# EAGLE schematic V1_schematic (EAGLE 8.3.0), part 1 of 2

## Sheet 1 of 6
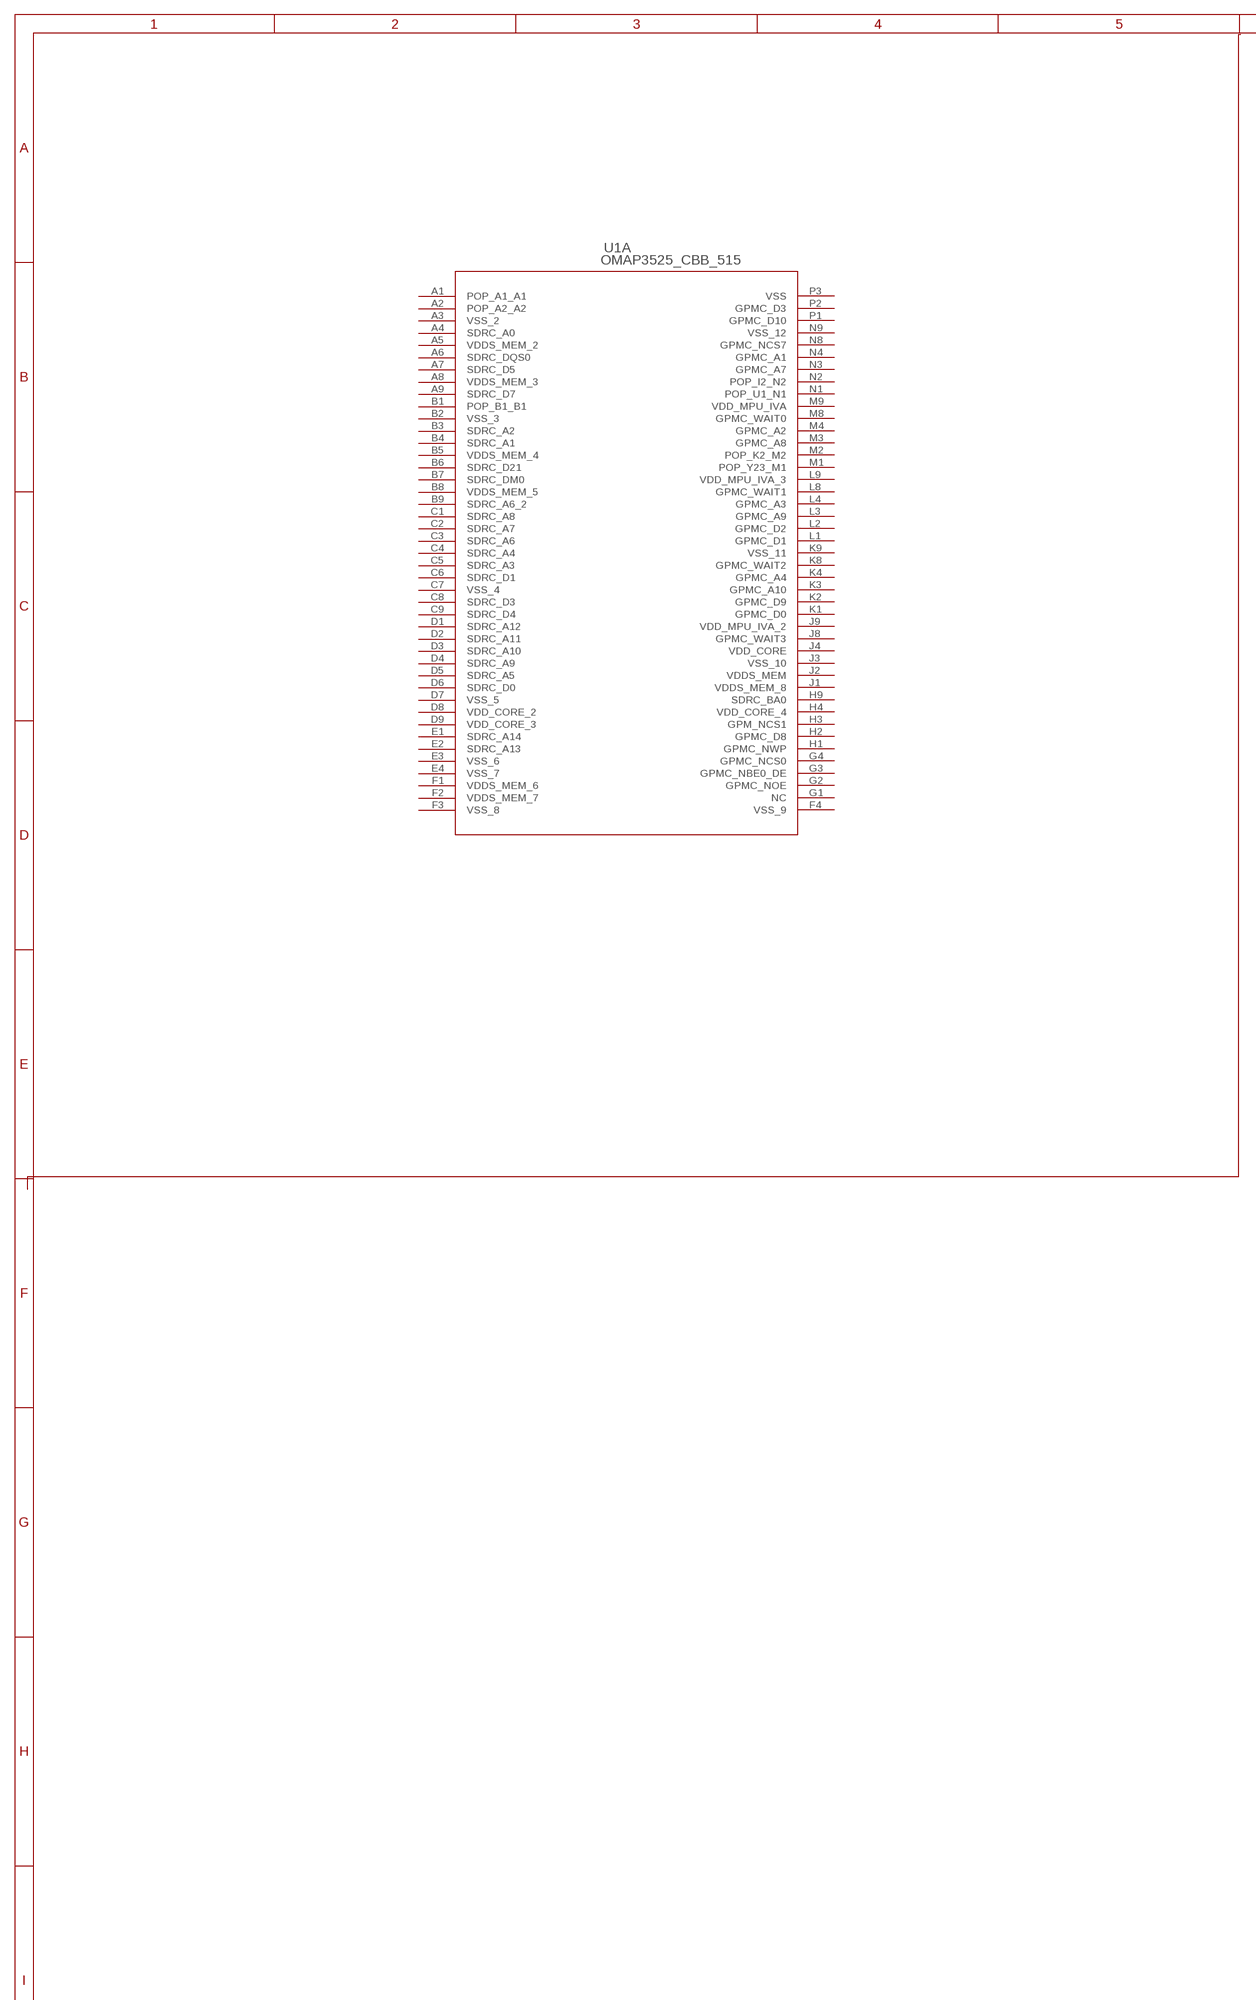
[diagram p0: schematic, sheet 1, part 1 of 2]
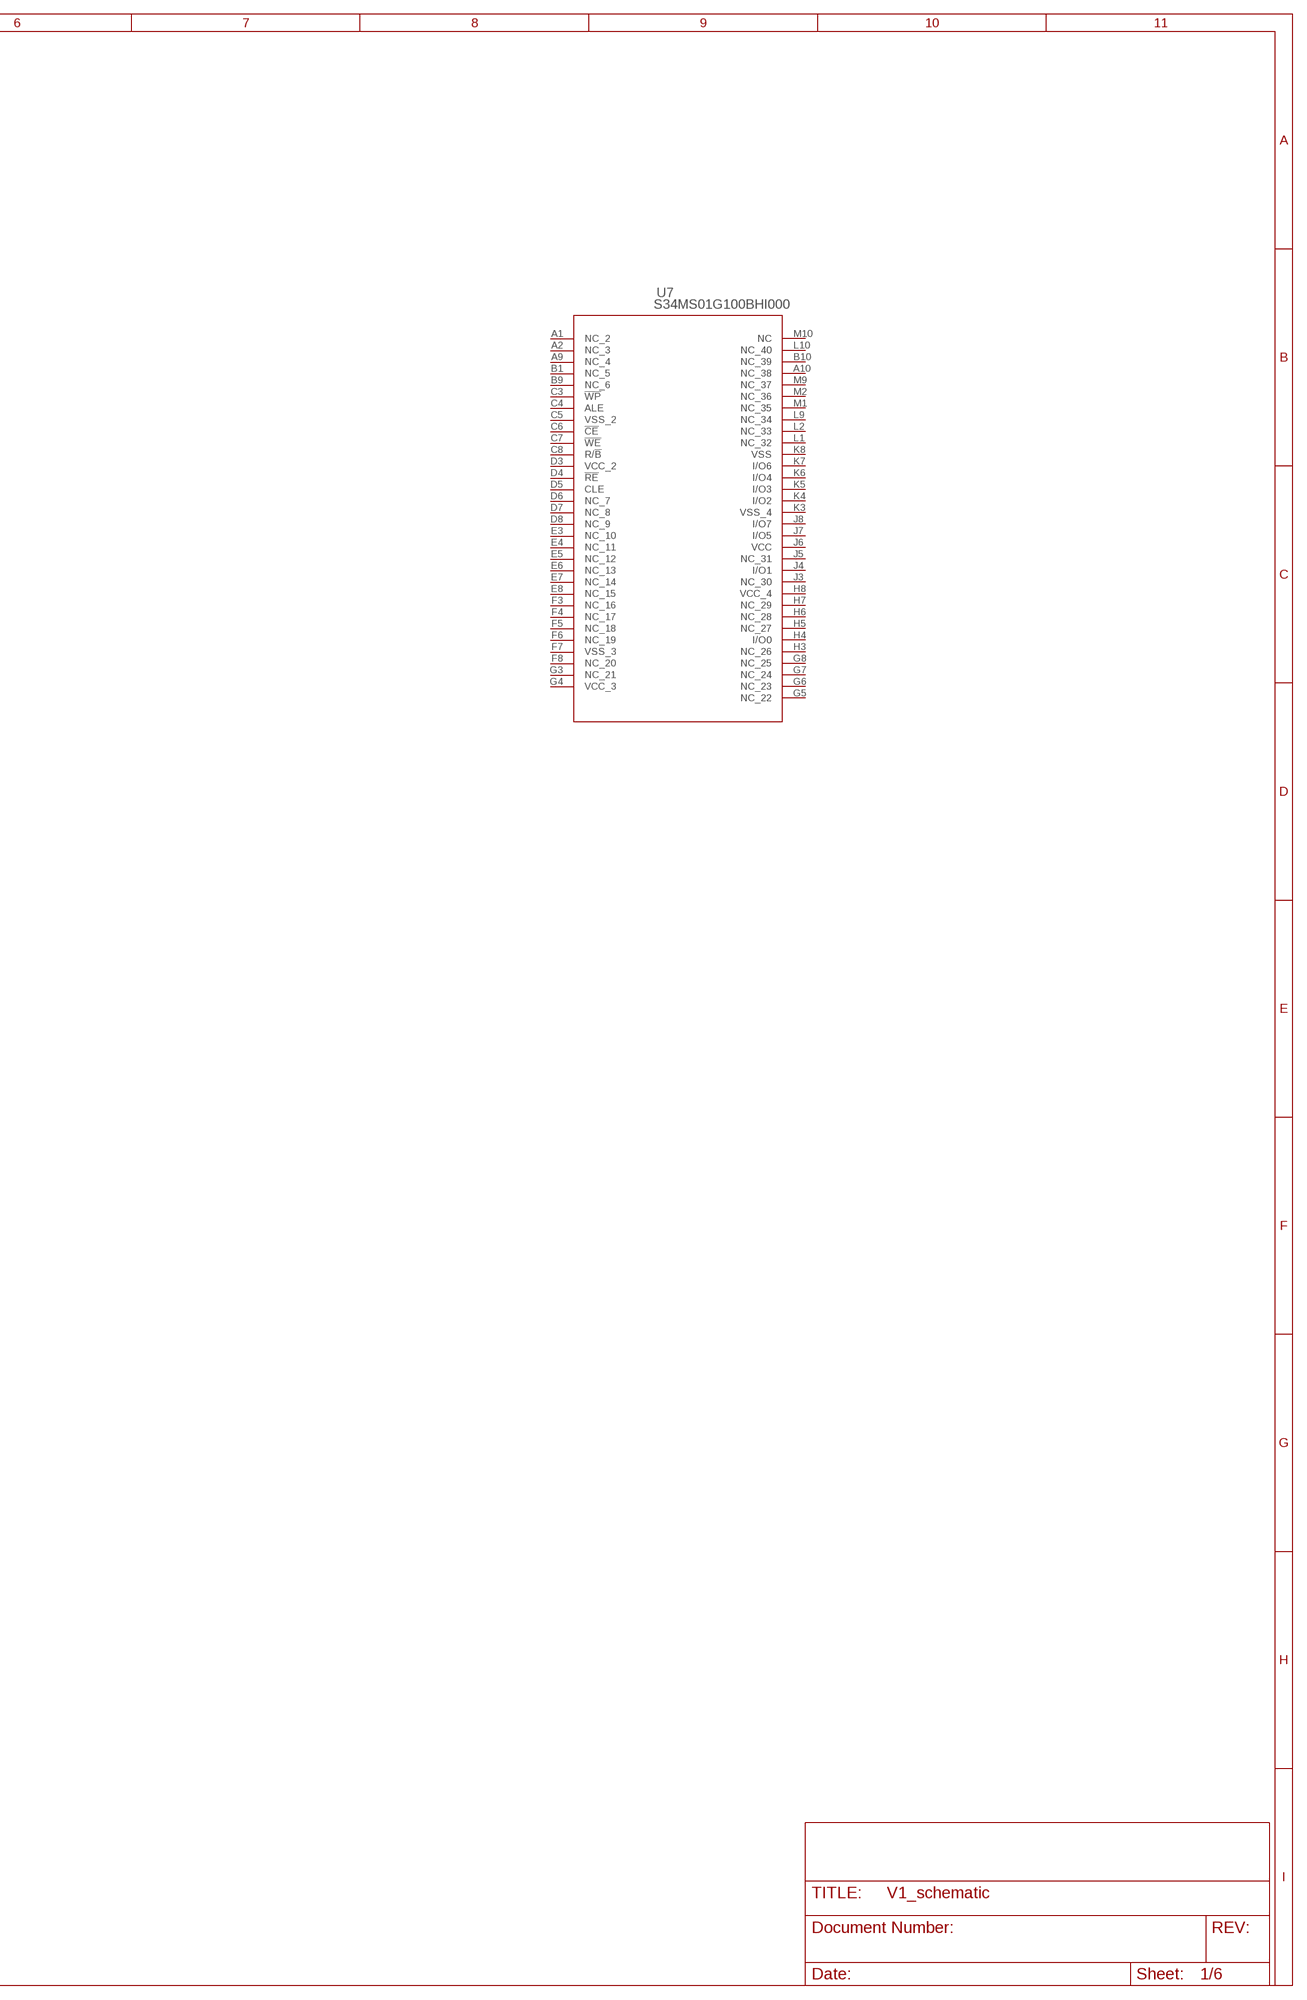
[diagram p1: schematic, sheet 1, part 2 of 2]

### Parts
U1  OMAP3525_CBB_515  [CBB515]
U7  S34MS01G100BHI000  [VBM063]
Unconnected: U1.A1(A:POP_A1_A1) U1.A2(A:POP_A2_A2) U1.A4(A:SDRC_A0) U1.A6(A:SDRC_DQS0) U1.A7(A:SDRC_D5) U1.A9(A:SDRC_D7) U1.A10(B:SDRC_DQS2) U1.A11(B:SDRC_D21) U1.A13(B:SDRC_CLK) U1.A14(B:SDRC_NCLK) U1.A15(B:POP_A12_A15) U1.A16(B:SDRC_DM1) U1.A17(B:SDRC_DQS1) U1.A19(B:SDRC_D25) U1.A20(B:SDRC_DQS3) U1.A21(B:SDRC_D29) U1.A23(B:CAM_VS) U1.A24(B:CAM_HS) U1.A25(B:CAM_D5) U1.A27(B:POP_A22_A27) U1.A28(B:POP_A23_A28) U1.AA1(B:POP_AA1_AA1) U1.AA2(B:POP_AA2_AA2) U1.AA3(B:MCSPI2_CLK) U1.AA4(B:MCSPI1_SOMI) U1.AA8(B:UART1_TX) U1.AA9(B:UART1_RTS) U1.AA10(E:JTAG_EMU1) U1.AA11(E:JTAG_EMU0) U1.AA12(E:JTAG_RTCK) U1.AA13(E:JTAG_TCK) U1.AA15(E:CAP_VDD_WKUP) U1.AA17(E:JTAG_NTRST) U1.AA18(E:JTAG_TMS_TMSC) U1.AA19(E:JTAG_TDO) U1.AA20(E:JTAG_TDI) U1.AA21(E:MCBSP1_FSR) U1.AA25(E:UART2_TX) U1.AA27(E:DSS_DATA15) U1.AA28(E:DSS_DATA14) U1.AB1(B:MCSPI1_CS2) U1.AB2(B:MCSPI1_CS3) U1.AB3(B:MCSPI1_CLK) U1.AB4(B:MCSPI1_SIMO) U1.AB25(E:UART2_RTS) U1.AB26(E:UART2_CTS) U1.AB27(E:DSS_DATA13) U1.AB28(F:DSS_DATA12) U1.AC1(B:MCSPI1_FSX) U1.AC2(B:MCSPI1_CS0) U1.AC3(B:MCSPI1_CS1) U1.AC27(F:DSS_DATA22) U1.AC28(F:DSS_DATA23) U1.AD1(B:MCBSP4_DR) U1.AD2(B:MCBSP4_DX) U1.AD25(F:UART2_RX) U1.AD26(F:I2C4_SCL) U1.AD27(F:DSS_DATA11) U1.AD28(F:DSS_DATA10) U1.AE1(B:MCBSP4_CLKX) U1.AE2(B:MMC2_CLK) U1.AE3(B:MMC2_DAT7) U1.AE4(B:MMC2_DAT4) U1.AE5(B:MCBSP3_FSX) U1.AE6(B:MCBSP3_DR) U1.AE7(B:ETK_D10) U1.AE10(F:ETK_CTL) U1.AE11(F:ETK_D4) U1.AE13(F:ETK_D3) U1.AE14(F:SYS_BOOT2) U1.AE15(F:I2C2_SDA) U1.AE17(F:SYS_XTALIN) U1.AE21(F:SYS_BOOT5) U1.AE22(F:SYS_CLKOUT2) U1.AE25(F:SYS_32K) U1.AE26(F:I2C4_SDA) U1.AE28(F:POP_AA23_AE28) U1.AF1(B:POP_AC8_AF1) U1.AF2(C:POP_U2_AF2) U1.AF3(C:MMC2_DAT6) U1.AF4(C:MMC2_DAT3) U1.AF5(C:MCBSP3_CLKX) U1.AF6(C:MCBSP3_DX) U1.AF7(C:ETK_D11) U1.AF9(C:ETK_D8) U1.AF10(F:ETK_CLK) U1.AF11(F:ETK_D0) U1.AF13(F:ETK_D6) U1.AF14(F:I2C3_SCL) U1.AF15(F:I2C2_SCL) U1.AF17(F:SYS_XTALOUT) U1.AF18(F:SYS_BOOT3) U1.AF19(F:SYS_BOOT4) U1.AF21(F:SYS_BOOT6) U1.AF22(F:SYS_OFF_MODE) U1.AF24(F:SYS_NRESWARM) U1.AF25(F:SYS_CLKREQ) U1.AF26(F:SYS_NIRQ) U1.AF27(F:POP_AA22_AF27) U1.AF28(F:POP_H23_AF28) U1.AG1(C:POP_AB1_AG1) U1.AG4(C:MMC2_DAT2) U1.AG5(C:MMC2_CMD) U1.AG7(C:ETK_D12) U1.AG8(C:ETK_D14) U1.AG9(C:ETK_D9) U1.AG10(F:POP_AB8_AG10) U1.AG11(F:POP_AB9_AG11) U1.AG12(F:ETK_D1) U1.AG13(F:POP_AB11_AG13) U1.AG14(F:I2C3_SDA) U1.AG15(F:POP_AB13_AG15) U1.AG17(F:CAM_D0) U1.AG18(F:GPIO_114) U1.AG19(F:GPIO_112) U1.AG22(F:DSS_DATA0) U1.AG23(F:DSS_DATA2) U1.AG24(F:DSS_DATA4) U1.AG25(F:SYS_CLKOUT1) U1.AG26(F:SYS_BOOT1) U1.AG28(F:POP_AB23_AG28) U1.AH1(C:POP_AC1_AH1) U1.AH2(C:POP_AC2_AH2) U1.AH3(C:MMC2_DAT5) U1.AH4(C:MMC2_DAT1) U1.AH5(C:MMC2_DAT0) U1.AH7(C:ETK_D13) U1.AH8(C:ETK_D15) U1.AH9(C:ETK_D5) U1.AH10(F:POP_AC13_AH10) U1.AH11(F:POP_AC9_AH11) U1.AH12(F:ETK_D2) U1.AH13(F:POP_AC11_AH13) U1.AH14(F:ETK_D7) U1.AH15(F:POP_I1_AH15) U1.AH16(F:POP_AC14_AH16) U1.AH17(F:CAM_D1) U1.AH18(F:GPIO_115) U1.AH19(F:GPIO_113) U1.AH20(F:CAP_VDD_D) U1.AH22(F:DSS_DATA1) U1.AH23(F:DSS_DATA3) U1.AH24(F:DSS_DATA5) U1.AH25(F:SYS_NRESPWRON) U1.AH26(F:SYS_BOOT0) U1.AH27(F:POP_AC22_AH27) U1.AH28(F:POP_AC23_AH28) U1.B1(A:POP_B1_B1) U1.B3(A:SDRC_A2) U1.B4(A:SDRC_A1) U1.B6(A:SDRC_D21) U1.B7(A:SDRC_DM0) U1.B9(A:SDRC_A6_2) U1.B10(C:SDRC_D17) U1.B11(C:SDRC_DM2) U1.B13(C:SDRC_D22) U1.B14(C:SDRC_D9) U1.B15(C:POP_B12_B15) U1.B16(C:SDRC_D11) U1.B17(C:SDRC_D14) U1.B19(C:SDRC_D26) U1.B20(C:SDRC_D27) U1.B21(C:SDRC_D30) U1.B23(C:CAM_WEN) U1.B24(C:CAM_D2) U1.B25(C:CAM_D10) U1.B26(C:CAM_XCLKB) U1.B28(C:POP_B23_B28) U1.C1(A:SDRC_A8) U1.C2(A:SDRC_A7) U1.C3(A:SDRC_A6) U1.C4(A:SDRC_A4) U1.C5(A:SDRC_A3) U1.C6(A:SDRC_D1) U1.C8(A:SDRC_D3) U1.C9(A:SDRC_D4) U1.C11(C:SDRC_D18) U1.C12(C:SDRC_D20) U1.C14(C:SDRC_D8) U1.C15(C:SDRC_D10) U1.C17(C:SDRC_D13) U1.C18(C:SDRC_D24) U1.C20(C:SDRC_DM3) U1.C21(C:SDRC_D31) U1.C23(C:CAM_FLD) U1.C24(C:CAM_D3) U1.C25(C:CAM_XCLKA) U1.C26(C:CAM_D11) U1.C27(C:CAM_PCLK) U1.D1(A:SDRC_A12) U1.D2(A:SDRC_A11) U1.D3(A:SDRC_A10) U1.D4(A:SDRC_A9) U1.D5(A:SDRC_A5) U1.D6(A:SDRC_D0) U1.D11(C:SDRC_D16) U1.D12(C:SDRC_D19) U1.D14(C:SDRC_D23) U1.D17(C:SDRC_D12) U1.D18(C:SDRC_D15) U1.D20(C:SDRC_D28) U1.D24(C:CAM_D4) U1.D25(C:CAM_STROBE) U1.D26(C:DSS_HSYNC) U1.D27(C:DSS_VSYNC) U1.D28(C:DSS_PCLK) U1.E1(A:SDRC_A14) U1.E2(A:SDRC_A13) U1.E26(C:DSS_DATA6) U1.E27(C:DSS_ACBIAS) U1.E28(D:DSS_DATA20) U1.F27(D:DSS_DATA8) U1.F28(D:DSS_DATA7) U1.G1(A:NC) U1.G2(A:GPMC_NOE) U1.G3(A:GPMC_NBE0_DE) U1.G4(A:GPMC_NCS0) U1.G25(D:DSS_DATA16) U1.G26(D:DSS_DATA9) U1.H1(A:GPMC_NWP) U1.H2(A:GPMC_D8) U1.H3(A:GPM_NCS1) U1.H9(A:SDRC_BA0) U1.H10(D:SDRC_BA1) U1.H11(D:SDRC_NCS0) U1.H12(D:SDRC_NCS1) U1.H13(D:SDRC_NCAS) U1.H14(D:SDRC_NRAS) U1.H15(D:SDRC_NWE) U1.H16(D:SDRC_CKE0) U1.H17(D:SDRC_CKE1) U1.H18(D:UART3_CTS_RCTX) U1.H19(D:UART3_RTS_SD) U1.H20(D:UART3_RX_IRRX) U1.H21(D:UART3_TX_IRTX) U1.H25(D:DSS_DATA19) U1.H26(D:DSS_DATA18) U1.H27(D:DSS_DATA17) U1.J8(A:GPMC_WAIT3) U1.J21(D:I2C1_SDA) U1.J25(D:HDQ_SIO) U1.J26(D:DSS_DATA21) U1.J27(D:POP_H22_J27) U1.J28(D:POP_K1_J28) U1.K1(A:GPMC_D0) U1.K2(A:GPMC_D9) U1.K3(A:GPMC_A10) U1.K4(A:GPMC_A4) U1.K8(A:GPMC_WAIT2) U1.K21(D:I2C1_SCL) U1.K26(D:MCBSP1_FSX) U1.K27(D:CAM_D8) U1.K28(D:CAM_D6) U1.L1(A:GPMC_D1) U1.L2(A:GPMC_D2) U1.L3(A:GPMC_A9) U1.L4(A:GPMC_A3) U1.L8(A:GPMC_WAIT1) U1.L21(D:CAP_VDD_SRAM_CORE) U1.L25(D:CDD_CORE) U1.L27(D:CAM_D9) U1.L28(D:CAM_D7) U1.M1(A:POP_Y23_M1) U1.M2(A:POP_K2_M2) U1.M3(A:GPMC_A8) U1.M4(A:GPMC_A2) U1.M8(A:GPMC_WAIT0) U1.M21(D:MCBSP2_DX) U1.M26(D:POP_K22_M26) U1.M27(D:MMC1_CMD) U1.N1(A:POP_U1_N1) U1.N2(A:POP_I2_N2) U1.N3(A:GPMC_A7) U1.N4(A:GPMC_A1) U1.N8(A:GPMC_NCS7) U1.N21(D:MCBSP2_CLKX) U1.N25(D:MMC1_DAT2) U1.N26(D:MMC1_DAT1) U1.N27(D:MMC1_DA0) U1.N28(D:MMC1_CLK) U1.P1(A:GPMC_D10) U1.P2(A:GPMC_D3) U1.P8(B:GPMC_NCS6) U1.P21(D:MCBSP2_FSX) U1.P26(E:MMC1_DAT5) U1.P27(E:MMC1_DAT4) U1.P28(E:MMC1_DAT3) U1.R1(B:GPMC_D11) U1.R2(B:GPMC_D12) U1.R3(B:GPMC_A6) U1.R8(B:GPMC_NCS5) U1.R21(E:MCBSP2_DR) U1.R25(E:MMC1_DAT7) U1.R27(E:MMC1_DAT6) U1.R28(E:HSUSB0_DIR) U1.T1(B:GMC_D4) U1.T2(B:GPMC_D13) U1.T3(B:GPMC_A5) U1.T4(B:GPMC_CLK) U1.T8(B:GPMC_NCS4) U1.T21(E:MCBSP_CLKS) U1.T25(E:HSUSB0_STP) U1.T26(E:HSUSB0_NXT) U1.T27(E:HSUSB0_DATA0) U1.T28(E:HSUSB0_CLK) U1.U3(B:GPMC_NBE1) U1.U4(B:NC) U1.U8(B:GPMC_NCS3) U1.U21(E:MCBSP1_DR) U1.U25(E:HSUSB0_DATA4) U1.U26(E:HSUSB0_DATA3) U1.U27(E:HSUSB0_DATA2) U1.U28(E:HSUSB0_DATA1) U1.V1(B:GPMC_D5) U1.V2(B:GPMC_D6) U1.V3(B:MCSPI2_CS1) U1.V4(B:V4) U1.V8(B:GPMC_NCS2) U1.V21(E:MCBSP1_DX) U1.V26(E:HSUSB0_DATA7) U1.V27(E:HSUSB0_DATA6) U1.V28(E:HSUSB0_DATA5) U1.W1(B:GPMC_D14) U1.W2(B:GPMC_D7) U1.W8(B:UART1_CTS) U1.W21(E:MCBSP1_CLKX) U1.W26(E:TV_VREF) U1.W27(E:TV_VFB2) U1.W28(E:TV_OUT2) U1.Y1(B:GPMC_D15) U1.Y2(B:MCSPI2_SIMO) U1.Y3(B:MCSPI2_SOMI) U1.Y4(B:MCSPI2_CS0) U1.Y8(B:UART1_RX) U1.Y21(E:MCBSP1_CLKR) U1.Y27(E:TV_VFB1) U1.Y28(E:TV_OUT1) U7.A1(NC_2) U7.A2(NC_3) U7.A9(NC_4) U7.A10(NC_38) U7.B1(NC_5) U7.B9(NC_6) U7.B10(NC_39) U7.C3(!WP) U7.C4(ALE) U7.C6(!CE) U7.C7(!WE) U7.C8(R/!B) U7.D4(!RE) U7.D5(CLE) U7.D6(NC_7) U7.D7(NC_8) U7.D8(NC_9) U7.E3(NC_10) U7.E4(NC_11) U7.E5(NC_12) U7.E6(NC_13) U7.E7(NC_14) U7.E8(NC_15) U7.F3(NC_16) U7.F4(NC_17) U7.F5(NC_18) U7.F6(NC_19) U7.F8(NC_20) U7.G3(NC_21) U7.G5(NC_22) U7.G6(NC_23) U7.G7(NC_24) U7.G8(NC_25) U7.H3(NC_26) U7.H4(I/O0) U7.H5(NC_27) U7.H6(NC_28) U7.H7(NC_29) U7.J3(NC_30) U7.J4(I/O1) U7.J5(NC_31) U7.J7(I/O5) U7.J8(I/O7) U7.K4(I/O2) U7.K5(I/O3) U7.K6(I/O4) U7.K7(I/O6) U7.L1(NC_32) U7.L2(NC_33) U7.L9(NC_34) U7.L10(NC_40) U7.M1(NC_35) U7.M2(NC_36) U7.M9(NC_37) U7.M10(NC)

## Sheet 2 of 6
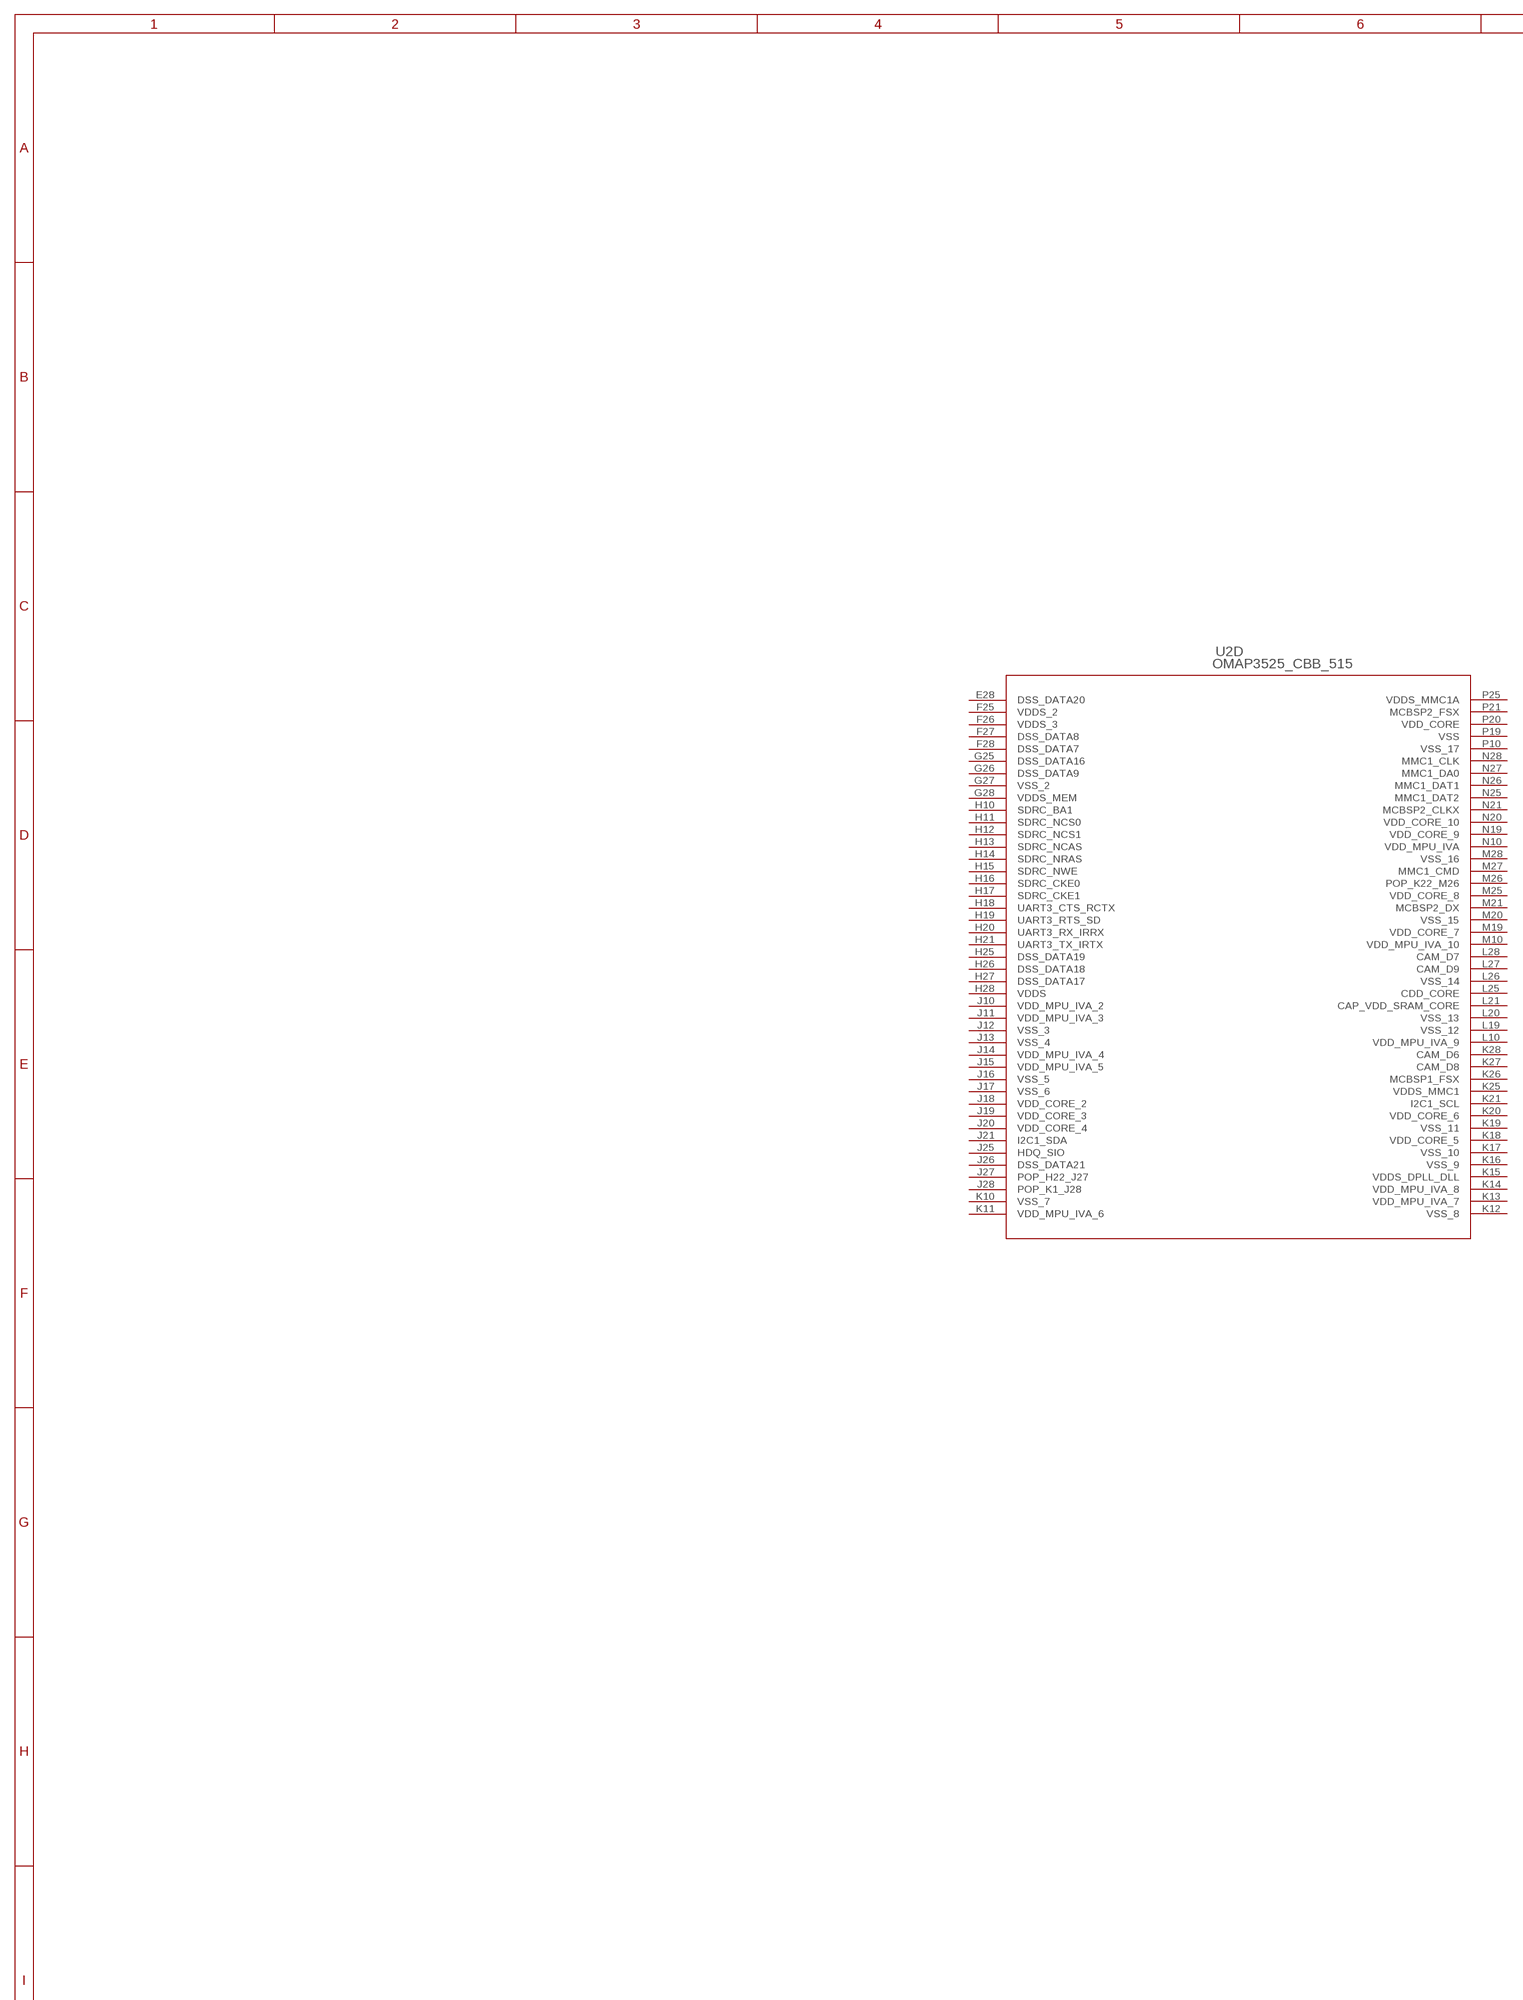
[diagram p2: schematic, sheet 2, part 1 of 2]
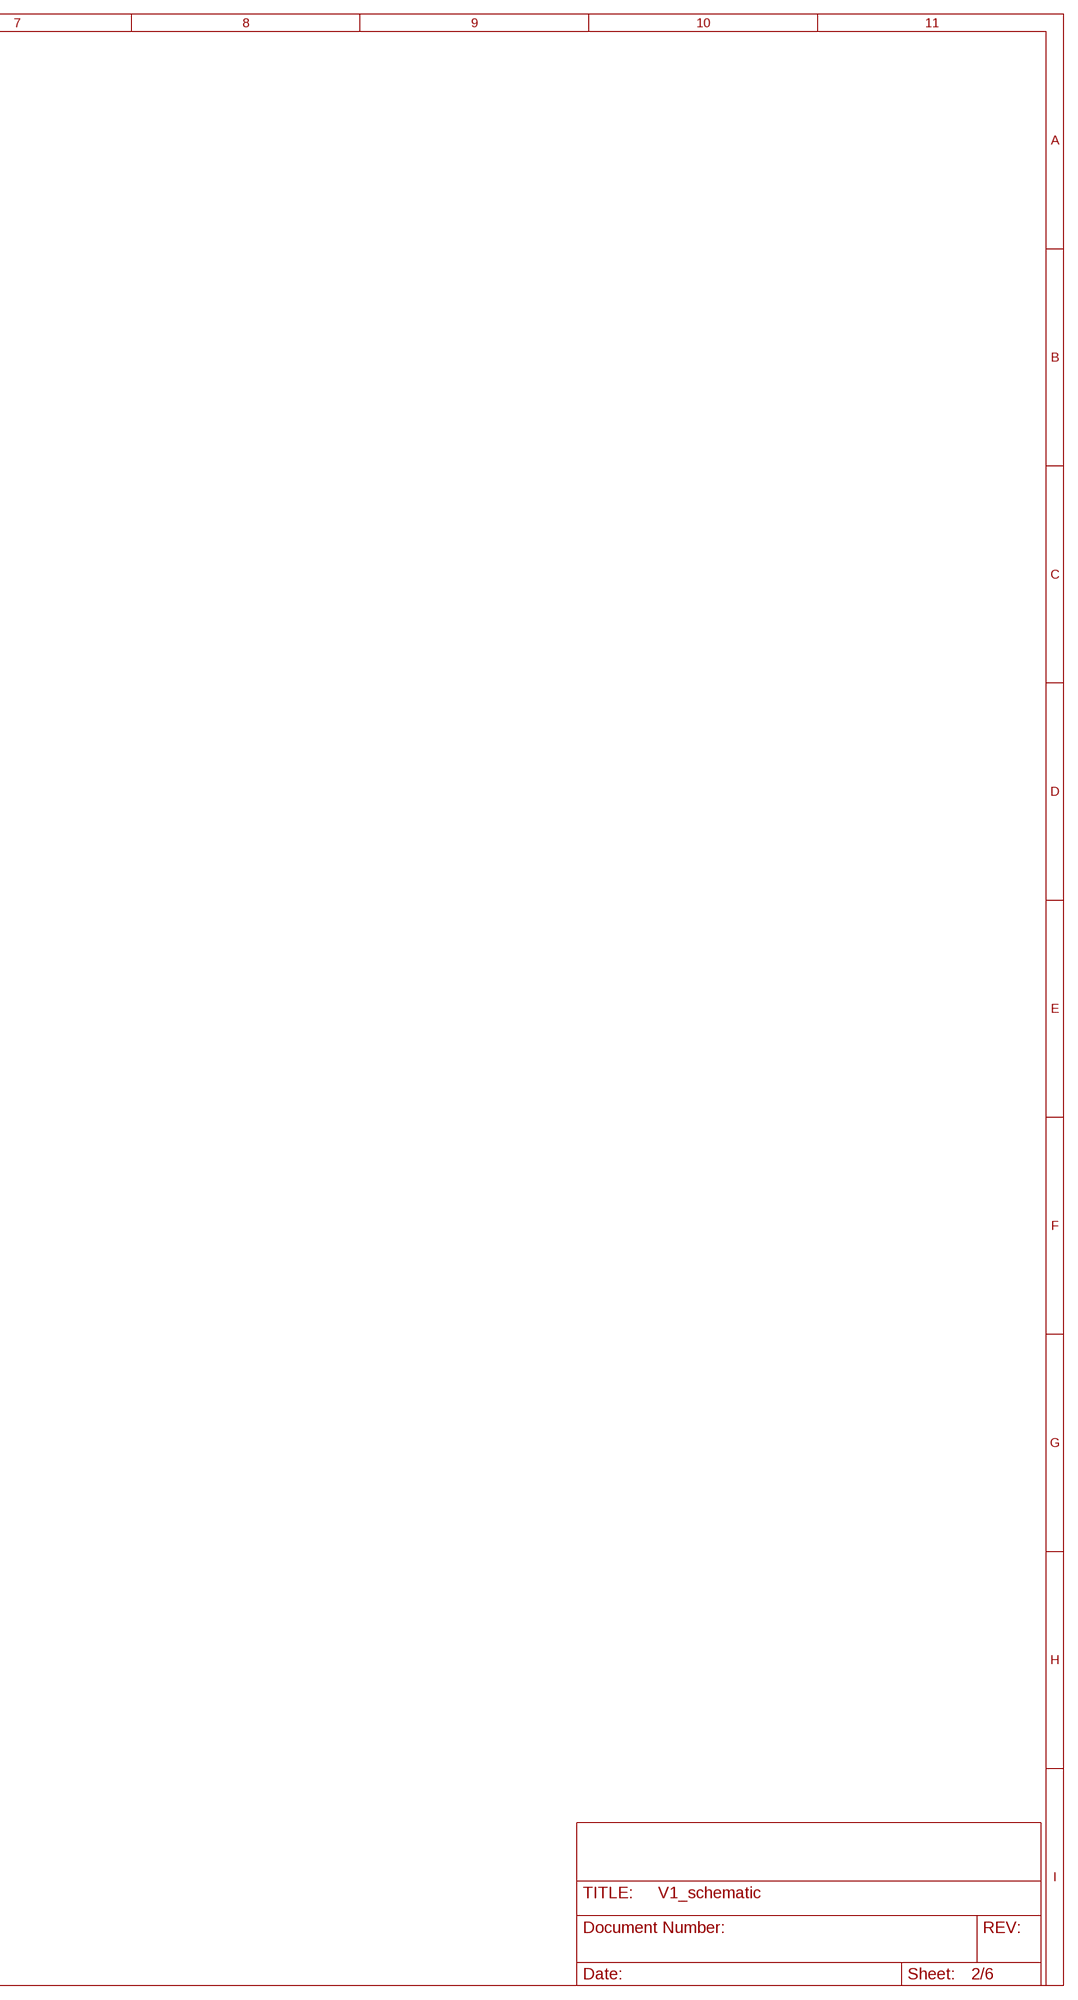
[diagram p3: schematic, sheet 2, part 2 of 2]

### Parts
U2  OMAP3525_CBB_515  [CBB515]
Unconnected: U2.A1(A:POP_A1_A1) U2.A2(A:POP_A2_A2) U2.A4(A:SDRC_A0) U2.A6(A:SDRC_DQS0) U2.A7(A:SDRC_D5) U2.A9(A:SDRC_D7) U2.A10(B:SDRC_DQS2) U2.A11(B:SDRC_D21) U2.A13(B:SDRC_CLK) U2.A14(B:SDRC_NCLK) U2.A15(B:POP_A12_A15) U2.A16(B:SDRC_DM1) U2.A17(B:SDRC_DQS1) U2.A19(B:SDRC_D25) U2.A20(B:SDRC_DQS3) U2.A21(B:SDRC_D29) U2.A23(B:CAM_VS) U2.A24(B:CAM_HS) U2.A25(B:CAM_D5) U2.A27(B:POP_A22_A27) U2.A28(B:POP_A23_A28) U2.AA1(B:POP_AA1_AA1) U2.AA2(B:POP_AA2_AA2) U2.AA3(B:MCSPI2_CLK) U2.AA4(B:MCSPI1_SOMI) U2.AA8(B:UART1_TX) U2.AA9(B:UART1_RTS) U2.AA10(E:JTAG_EMU1) U2.AA11(E:JTAG_EMU0) U2.AA12(E:JTAG_RTCK) U2.AA13(E:JTAG_TCK) U2.AA15(E:CAP_VDD_WKUP) U2.AA17(E:JTAG_NTRST) U2.AA18(E:JTAG_TMS_TMSC) U2.AA19(E:JTAG_TDO) U2.AA20(E:JTAG_TDI) U2.AA21(E:MCBSP1_FSR) U2.AA25(E:UART2_TX) U2.AA27(E:DSS_DATA15) U2.AA28(E:DSS_DATA14) U2.AB1(B:MCSPI1_CS2) U2.AB2(B:MCSPI1_CS3) U2.AB3(B:MCSPI1_CLK) U2.AB4(B:MCSPI1_SIMO) U2.AB25(E:UART2_RTS) U2.AB26(E:UART2_CTS) U2.AB27(E:DSS_DATA13) U2.AB28(F:DSS_DATA12) U2.AC1(B:MCSPI1_FSX) U2.AC2(B:MCSPI1_CS0) U2.AC3(B:MCSPI1_CS1) U2.AC27(F:DSS_DATA22) U2.AC28(F:DSS_DATA23) U2.AD1(B:MCBSP4_DR) U2.AD2(B:MCBSP4_DX) U2.AD25(F:UART2_RX) U2.AD26(F:I2C4_SCL) U2.AD27(F:DSS_DATA11) U2.AD28(F:DSS_DATA10) U2.AE1(B:MCBSP4_CLKX) U2.AE2(B:MMC2_CLK) U2.AE3(B:MMC2_DAT7) U2.AE4(B:MMC2_DAT4) U2.AE5(B:MCBSP3_FSX) U2.AE6(B:MCBSP3_DR) U2.AE7(B:ETK_D10) U2.AE10(F:ETK_CTL) U2.AE11(F:ETK_D4) U2.AE13(F:ETK_D3) U2.AE14(F:SYS_BOOT2) U2.AE15(F:I2C2_SDA) U2.AE17(F:SYS_XTALIN) U2.AE21(F:SYS_BOOT5) U2.AE22(F:SYS_CLKOUT2) U2.AE25(F:SYS_32K) U2.AE26(F:I2C4_SDA) U2.AE28(F:POP_AA23_AE28) U2.AF1(B:POP_AC8_AF1) U2.AF2(C:POP_U2_AF2) U2.AF3(C:MMC2_DAT6) U2.AF4(C:MMC2_DAT3) U2.AF5(C:MCBSP3_CLKX) U2.AF6(C:MCBSP3_DX) U2.AF7(C:ETK_D11) U2.AF9(C:ETK_D8) U2.AF10(F:ETK_CLK) U2.AF11(F:ETK_D0) U2.AF13(F:ETK_D6) U2.AF14(F:I2C3_SCL) U2.AF15(F:I2C2_SCL) U2.AF17(F:SYS_XTALOUT) U2.AF18(F:SYS_BOOT3) U2.AF19(F:SYS_BOOT4) U2.AF21(F:SYS_BOOT6) U2.AF22(F:SYS_OFF_MODE) U2.AF24(F:SYS_NRESWARM) U2.AF25(F:SYS_CLKREQ) U2.AF26(F:SYS_NIRQ) U2.AF27(F:POP_AA22_AF27) U2.AF28(F:POP_H23_AF28) U2.AG1(C:POP_AB1_AG1) U2.AG4(C:MMC2_DAT2) U2.AG5(C:MMC2_CMD) U2.AG7(C:ETK_D12) U2.AG8(C:ETK_D14) U2.AG9(C:ETK_D9) U2.AG10(F:POP_AB8_AG10) U2.AG11(F:POP_AB9_AG11) U2.AG12(F:ETK_D1) U2.AG13(F:POP_AB11_AG13) U2.AG14(F:I2C3_SDA) U2.AG15(F:POP_AB13_AG15) U2.AG17(F:CAM_D0) U2.AG18(F:GPIO_114) U2.AG19(F:GPIO_112) U2.AG22(F:DSS_DATA0) U2.AG23(F:DSS_DATA2) U2.AG24(F:DSS_DATA4) U2.AG25(F:SYS_CLKOUT1) U2.AG26(F:SYS_BOOT1) U2.AG28(F:POP_AB23_AG28) U2.AH1(C:POP_AC1_AH1) U2.AH2(C:POP_AC2_AH2) U2.AH3(C:MMC2_DAT5) U2.AH4(C:MMC2_DAT1) U2.AH5(C:MMC2_DAT0) U2.AH7(C:ETK_D13) U2.AH8(C:ETK_D15) U2.AH9(C:ETK_D5) U2.AH10(F:POP_AC13_AH10) U2.AH11(F:POP_AC9_AH11) U2.AH12(F:ETK_D2) U2.AH13(F:POP_AC11_AH13) U2.AH14(F:ETK_D7) U2.AH15(F:POP_I1_AH15) U2.AH16(F:POP_AC14_AH16) U2.AH17(F:CAM_D1) U2.AH18(F:GPIO_115) U2.AH19(F:GPIO_113) U2.AH20(F:CAP_VDD_D) U2.AH22(F:DSS_DATA1) U2.AH23(F:DSS_DATA3) U2.AH24(F:DSS_DATA5) U2.AH25(F:SYS_NRESPWRON) U2.AH26(F:SYS_BOOT0) U2.AH27(F:POP_AC22_AH27) U2.AH28(F:POP_AC23_AH28) U2.B1(A:POP_B1_B1) U2.B3(A:SDRC_A2) U2.B4(A:SDRC_A1) U2.B6(A:SDRC_D21) U2.B7(A:SDRC_DM0) U2.B9(A:SDRC_A6_2) U2.B10(C:SDRC_D17) U2.B11(C:SDRC_DM2) U2.B13(C:SDRC_D22) U2.B14(C:SDRC_D9) U2.B15(C:POP_B12_B15) U2.B16(C:SDRC_D11) U2.B17(C:SDRC_D14) U2.B19(C:SDRC_D26) U2.B20(C:SDRC_D27) U2.B21(C:SDRC_D30) U2.B23(C:CAM_WEN) U2.B24(C:CAM_D2) U2.B25(C:CAM_D10) U2.B26(C:CAM_XCLKB) U2.B28(C:POP_B23_B28) U2.C1(A:SDRC_A8) U2.C2(A:SDRC_A7) U2.C3(A:SDRC_A6) U2.C4(A:SDRC_A4) U2.C5(A:SDRC_A3) U2.C6(A:SDRC_D1) U2.C8(A:SDRC_D3) U2.C9(A:SDRC_D4) U2.C11(C:SDRC_D18) U2.C12(C:SDRC_D20) U2.C14(C:SDRC_D8) U2.C15(C:SDRC_D10) U2.C17(C:SDRC_D13) U2.C18(C:SDRC_D24) U2.C20(C:SDRC_DM3) U2.C21(C:SDRC_D31) U2.C23(C:CAM_FLD) U2.C24(C:CAM_D3) U2.C25(C:CAM_XCLKA) U2.C26(C:CAM_D11) U2.C27(C:CAM_PCLK) U2.D1(A:SDRC_A12) U2.D2(A:SDRC_A11) U2.D3(A:SDRC_A10) U2.D4(A:SDRC_A9) U2.D5(A:SDRC_A5) U2.D6(A:SDRC_D0) U2.D11(C:SDRC_D16) U2.D12(C:SDRC_D19) U2.D14(C:SDRC_D23) U2.D17(C:SDRC_D12) U2.D18(C:SDRC_D15) U2.D20(C:SDRC_D28) U2.D24(C:CAM_D4) U2.D25(C:CAM_STROBE) U2.D26(C:DSS_HSYNC) U2.D27(C:DSS_VSYNC) U2.D28(C:DSS_PCLK) U2.E1(A:SDRC_A14) U2.E2(A:SDRC_A13) U2.E26(C:DSS_DATA6) U2.E27(C:DSS_ACBIAS) U2.E28(D:DSS_DATA20) U2.F27(D:DSS_DATA8) U2.F28(D:DSS_DATA7) U2.G1(A:NC) U2.G2(A:GPMC_NOE) U2.G3(A:GPMC_NBE0_DE) U2.G4(A:GPMC_NCS0) U2.G25(D:DSS_DATA16) U2.G26(D:DSS_DATA9) U2.H1(A:GPMC_NWP) U2.H2(A:GPMC_D8) U2.H3(A:GPM_NCS1) U2.H9(A:SDRC_BA0) U2.H10(D:SDRC_BA1) U2.H11(D:SDRC_NCS0) U2.H12(D:SDRC_NCS1) U2.H13(D:SDRC_NCAS) U2.H14(D:SDRC_NRAS) U2.H15(D:SDRC_NWE) U2.H16(D:SDRC_CKE0) U2.H17(D:SDRC_CKE1) U2.H18(D:UART3_CTS_RCTX) U2.H19(D:UART3_RTS_SD) U2.H20(D:UART3_RX_IRRX) U2.H21(D:UART3_TX_IRTX) U2.H25(D:DSS_DATA19) U2.H26(D:DSS_DATA18) U2.H27(D:DSS_DATA17) U2.J8(A:GPMC_WAIT3) U2.J21(D:I2C1_SDA) U2.J25(D:HDQ_SIO) U2.J26(D:DSS_DATA21) U2.J27(D:POP_H22_J27) U2.J28(D:POP_K1_J28) U2.K1(A:GPMC_D0) U2.K2(A:GPMC_D9) U2.K3(A:GPMC_A10) U2.K4(A:GPMC_A4) U2.K8(A:GPMC_WAIT2) U2.K21(D:I2C1_SCL) U2.K26(D:MCBSP1_FSX) U2.K27(D:CAM_D8) U2.K28(D:CAM_D6) U2.L1(A:GPMC_D1) U2.L2(A:GPMC_D2) U2.L3(A:GPMC_A9) U2.L4(A:GPMC_A3) U2.L8(A:GPMC_WAIT1) U2.L21(D:CAP_VDD_SRAM_CORE) U2.L25(D:CDD_CORE) U2.L27(D:CAM_D9) U2.L28(D:CAM_D7) U2.M1(A:POP_Y23_M1) U2.M2(A:POP_K2_M2) U2.M3(A:GPMC_A8) U2.M4(A:GPMC_A2) U2.M8(A:GPMC_WAIT0) U2.M21(D:MCBSP2_DX) U2.M26(D:POP_K22_M26) U2.M27(D:MMC1_CMD) U2.N1(A:POP_U1_N1) U2.N2(A:POP_I2_N2) U2.N3(A:GPMC_A7) U2.N4(A:GPMC_A1) U2.N8(A:GPMC_NCS7) U2.N21(D:MCBSP2_CLKX) U2.N25(D:MMC1_DAT2) U2.N26(D:MMC1_DAT1) U2.N27(D:MMC1_DA0) U2.N28(D:MMC1_CLK) U2.P1(A:GPMC_D10) U2.P2(A:GPMC_D3) U2.P8(B:GPMC_NCS6) U2.P21(D:MCBSP2_FSX) U2.P26(E:MMC1_DAT5) U2.P27(E:MMC1_DAT4) U2.P28(E:MMC1_DAT3) U2.R1(B:GPMC_D11) U2.R2(B:GPMC_D12) U2.R3(B:GPMC_A6) U2.R8(B:GPMC_NCS5) U2.R21(E:MCBSP2_DR) U2.R25(E:MMC1_DAT7) U2.R27(E:MMC1_DAT6) U2.R28(E:HSUSB0_DIR) U2.T1(B:GMC_D4) U2.T2(B:GPMC_D13) U2.T3(B:GPMC_A5) U2.T4(B:GPMC_CLK) U2.T8(B:GPMC_NCS4) U2.T21(E:MCBSP_CLKS) U2.T25(E:HSUSB0_STP) U2.T26(E:HSUSB0_NXT) U2.T27(E:HSUSB0_DATA0) U2.T28(E:HSUSB0_CLK) U2.U3(B:GPMC_NBE1) U2.U4(B:NC) U2.U8(B:GPMC_NCS3) U2.U21(E:MCBSP1_DR) U2.U25(E:HSUSB0_DATA4) U2.U26(E:HSUSB0_DATA3) U2.U27(E:HSUSB0_DATA2) U2.U28(E:HSUSB0_DATA1) U2.V1(B:GPMC_D5) U2.V2(B:GPMC_D6) U2.V3(B:MCSPI2_CS1) U2.V4(B:V4) U2.V8(B:GPMC_NCS2) U2.V21(E:MCBSP1_DX) U2.V26(E:HSUSB0_DATA7) U2.V27(E:HSUSB0_DATA6) U2.V28(E:HSUSB0_DATA5) U2.W1(B:GPMC_D14) U2.W2(B:GPMC_D7) U2.W8(B:UART1_CTS) U2.W21(E:MCBSP1_CLKX) U2.W26(E:TV_VREF) U2.W27(E:TV_VFB2) U2.W28(E:TV_OUT2) U2.Y1(B:GPMC_D15) U2.Y2(B:MCSPI2_SIMO) U2.Y3(B:MCSPI2_SOMI) U2.Y4(B:MCSPI2_CS0) U2.Y8(B:UART1_RX) U2.Y21(E:MCBSP1_CLKR) U2.Y27(E:TV_VFB1) U2.Y28(E:TV_OUT1)

## Sheet 3 of 6
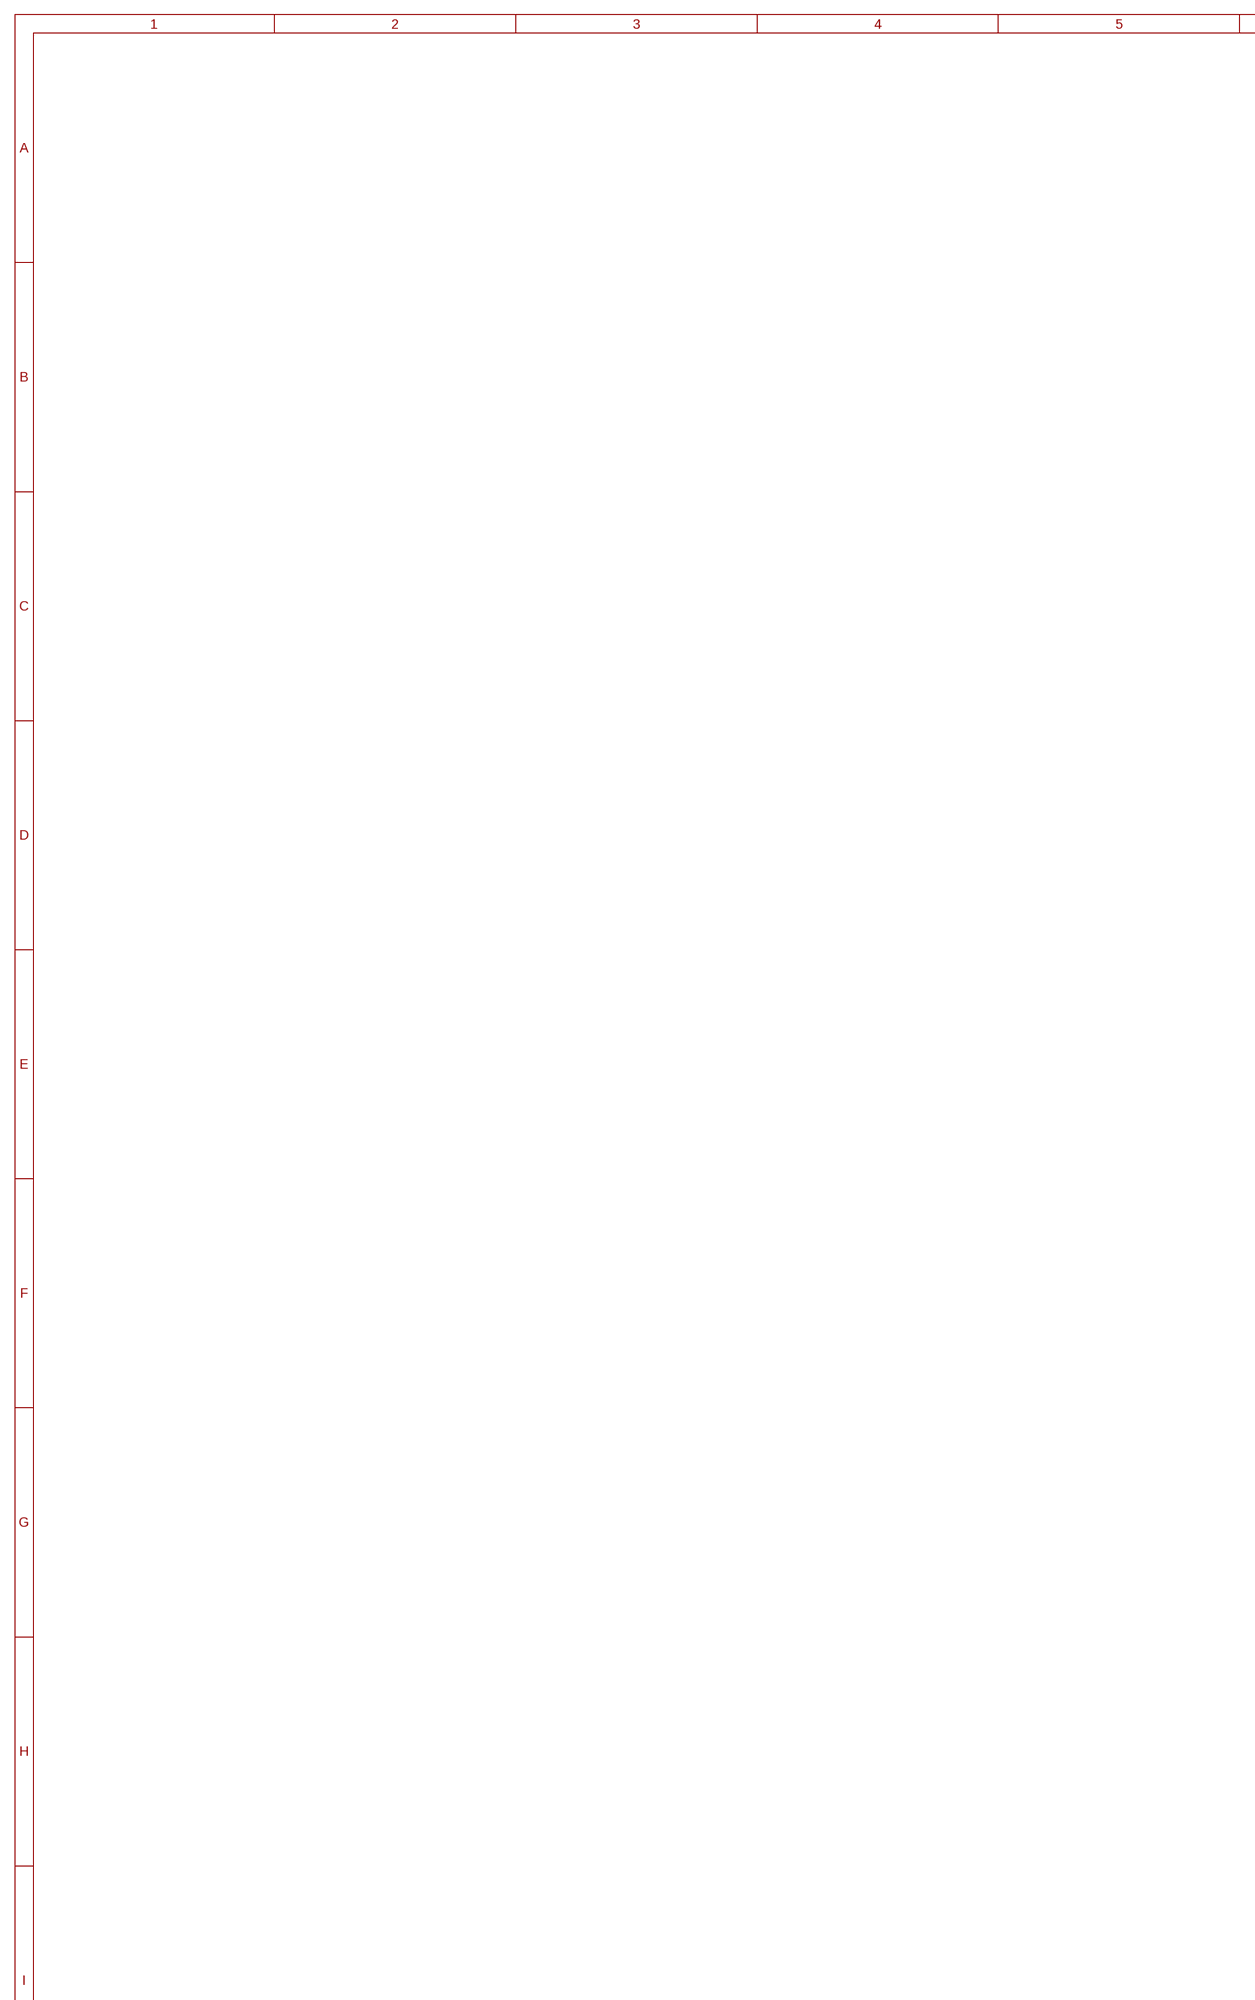
[diagram p4: schematic, sheet 3, part 1 of 2]
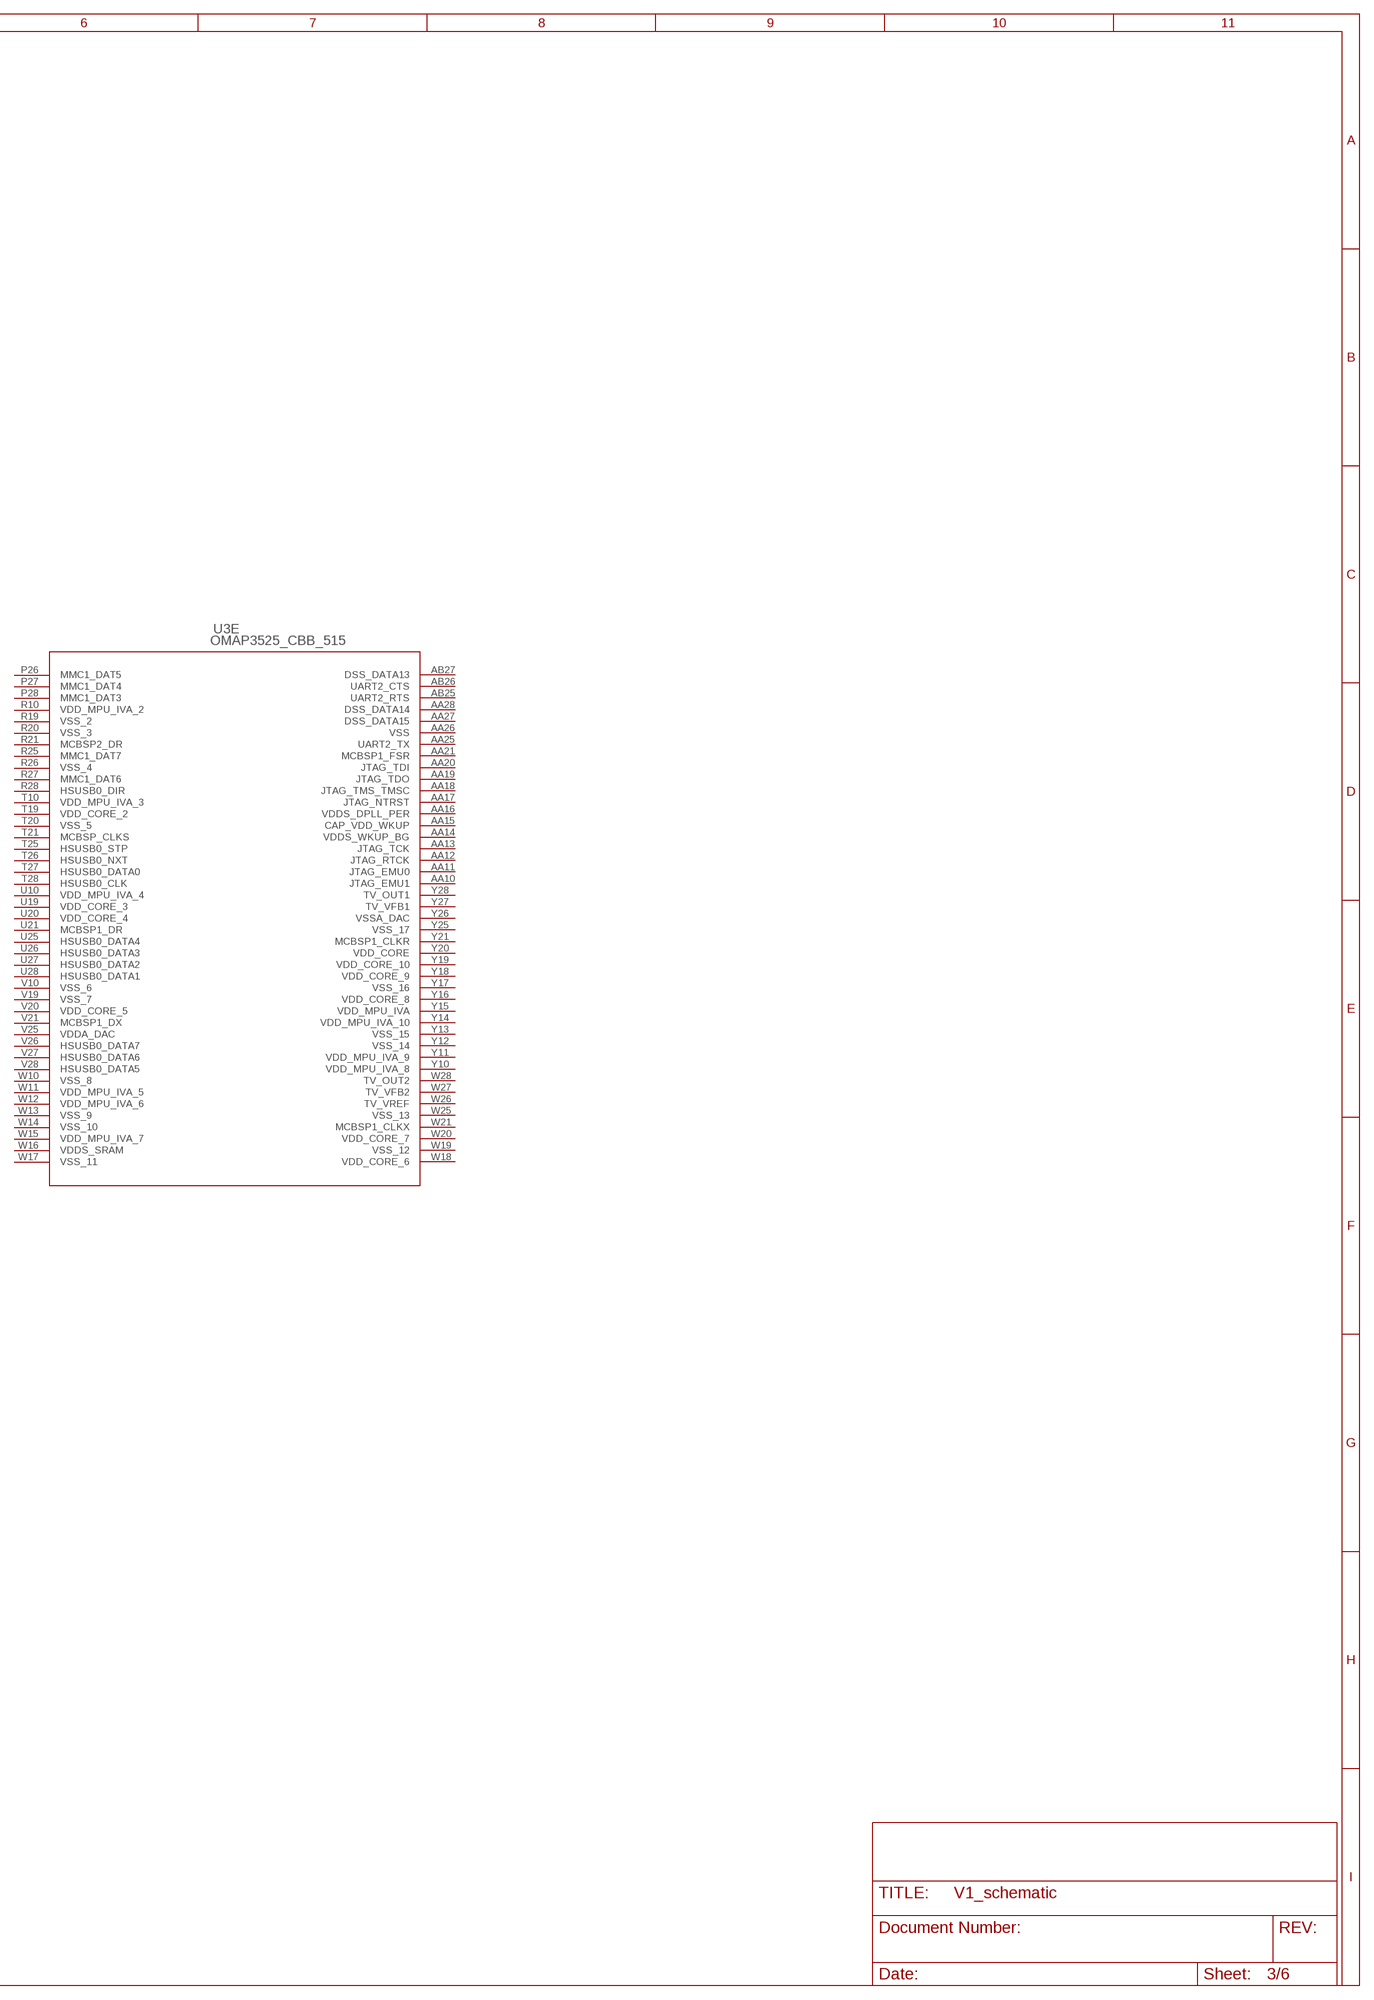
[diagram p5: schematic, sheet 3, part 2 of 2]

### Parts
U3  OMAP3525_CBB_515  [CBB515]
Unconnected: U3.A1(A:POP_A1_A1) U3.A2(A:POP_A2_A2) U3.A4(A:SDRC_A0) U3.A6(A:SDRC_DQS0) U3.A7(A:SDRC_D5) U3.A9(A:SDRC_D7) U3.A10(B:SDRC_DQS2) U3.A11(B:SDRC_D21) U3.A13(B:SDRC_CLK) U3.A14(B:SDRC_NCLK) U3.A15(B:POP_A12_A15) U3.A16(B:SDRC_DM1) U3.A17(B:SDRC_DQS1) U3.A19(B:SDRC_D25) U3.A20(B:SDRC_DQS3) U3.A21(B:SDRC_D29) U3.A23(B:CAM_VS) U3.A24(B:CAM_HS) U3.A25(B:CAM_D5) U3.A27(B:POP_A22_A27) U3.A28(B:POP_A23_A28) U3.AA1(B:POP_AA1_AA1) U3.AA2(B:POP_AA2_AA2) U3.AA3(B:MCSPI2_CLK) U3.AA4(B:MCSPI1_SOMI) U3.AA8(B:UART1_TX) U3.AA9(B:UART1_RTS) U3.AA10(E:JTAG_EMU1) U3.AA11(E:JTAG_EMU0) U3.AA12(E:JTAG_RTCK) U3.AA13(E:JTAG_TCK) U3.AA15(E:CAP_VDD_WKUP) U3.AA17(E:JTAG_NTRST) U3.AA18(E:JTAG_TMS_TMSC) U3.AA19(E:JTAG_TDO) U3.AA20(E:JTAG_TDI) U3.AA21(E:MCBSP1_FSR) U3.AA25(E:UART2_TX) U3.AA27(E:DSS_DATA15) U3.AA28(E:DSS_DATA14) U3.AB1(B:MCSPI1_CS2) U3.AB2(B:MCSPI1_CS3) U3.AB3(B:MCSPI1_CLK) U3.AB4(B:MCSPI1_SIMO) U3.AB25(E:UART2_RTS) U3.AB26(E:UART2_CTS) U3.AB27(E:DSS_DATA13) U3.AB28(F:DSS_DATA12) U3.AC1(B:MCSPI1_FSX) U3.AC2(B:MCSPI1_CS0) U3.AC3(B:MCSPI1_CS1) U3.AC27(F:DSS_DATA22) U3.AC28(F:DSS_DATA23) U3.AD1(B:MCBSP4_DR) U3.AD2(B:MCBSP4_DX) U3.AD25(F:UART2_RX) U3.AD26(F:I2C4_SCL) U3.AD27(F:DSS_DATA11) U3.AD28(F:DSS_DATA10) U3.AE1(B:MCBSP4_CLKX) U3.AE2(B:MMC2_CLK) U3.AE3(B:MMC2_DAT7) U3.AE4(B:MMC2_DAT4) U3.AE5(B:MCBSP3_FSX) U3.AE6(B:MCBSP3_DR) U3.AE7(B:ETK_D10) U3.AE10(F:ETK_CTL) U3.AE11(F:ETK_D4) U3.AE13(F:ETK_D3) U3.AE14(F:SYS_BOOT2) U3.AE15(F:I2C2_SDA) U3.AE17(F:SYS_XTALIN) U3.AE21(F:SYS_BOOT5) U3.AE22(F:SYS_CLKOUT2) U3.AE25(F:SYS_32K) U3.AE26(F:I2C4_SDA) U3.AE28(F:POP_AA23_AE28) U3.AF1(B:POP_AC8_AF1) U3.AF2(C:POP_U2_AF2) U3.AF3(C:MMC2_DAT6) U3.AF4(C:MMC2_DAT3) U3.AF5(C:MCBSP3_CLKX) U3.AF6(C:MCBSP3_DX) U3.AF7(C:ETK_D11) U3.AF9(C:ETK_D8) U3.AF10(F:ETK_CLK) U3.AF11(F:ETK_D0) U3.AF13(F:ETK_D6) U3.AF14(F:I2C3_SCL) U3.AF15(F:I2C2_SCL) U3.AF17(F:SYS_XTALOUT) U3.AF18(F:SYS_BOOT3) U3.AF19(F:SYS_BOOT4) U3.AF21(F:SYS_BOOT6) U3.AF22(F:SYS_OFF_MODE) U3.AF24(F:SYS_NRESWARM) U3.AF25(F:SYS_CLKREQ) U3.AF26(F:SYS_NIRQ) U3.AF27(F:POP_AA22_AF27) U3.AF28(F:POP_H23_AF28) U3.AG1(C:POP_AB1_AG1) U3.AG4(C:MMC2_DAT2) U3.AG5(C:MMC2_CMD) U3.AG7(C:ETK_D12) U3.AG8(C:ETK_D14) U3.AG9(C:ETK_D9) U3.AG10(F:POP_AB8_AG10) U3.AG11(F:POP_AB9_AG11) U3.AG12(F:ETK_D1) U3.AG13(F:POP_AB11_AG13) U3.AG14(F:I2C3_SDA) U3.AG15(F:POP_AB13_AG15) U3.AG17(F:CAM_D0) U3.AG18(F:GPIO_114) U3.AG19(F:GPIO_112) U3.AG22(F:DSS_DATA0) U3.AG23(F:DSS_DATA2) U3.AG24(F:DSS_DATA4) U3.AG25(F:SYS_CLKOUT1) U3.AG26(F:SYS_BOOT1) U3.AG28(F:POP_AB23_AG28) U3.AH1(C:POP_AC1_AH1) U3.AH2(C:POP_AC2_AH2) U3.AH3(C:MMC2_DAT5) U3.AH4(C:MMC2_DAT1) U3.AH5(C:MMC2_DAT0) U3.AH7(C:ETK_D13) U3.AH8(C:ETK_D15) U3.AH9(C:ETK_D5) U3.AH10(F:POP_AC13_AH10) U3.AH11(F:POP_AC9_AH11) U3.AH12(F:ETK_D2) U3.AH13(F:POP_AC11_AH13) U3.AH14(F:ETK_D7) U3.AH15(F:POP_I1_AH15) U3.AH16(F:POP_AC14_AH16) U3.AH17(F:CAM_D1) U3.AH18(F:GPIO_115) U3.AH19(F:GPIO_113) U3.AH20(F:CAP_VDD_D) U3.AH22(F:DSS_DATA1) U3.AH23(F:DSS_DATA3) U3.AH24(F:DSS_DATA5) U3.AH25(F:SYS_NRESPWRON) U3.AH26(F:SYS_BOOT0) U3.AH27(F:POP_AC22_AH27) U3.AH28(F:POP_AC23_AH28) U3.B1(A:POP_B1_B1) U3.B3(A:SDRC_A2) U3.B4(A:SDRC_A1) U3.B6(A:SDRC_D21) U3.B7(A:SDRC_DM0) U3.B9(A:SDRC_A6_2) U3.B10(C:SDRC_D17) U3.B11(C:SDRC_DM2) U3.B13(C:SDRC_D22) U3.B14(C:SDRC_D9) U3.B15(C:POP_B12_B15) U3.B16(C:SDRC_D11) U3.B17(C:SDRC_D14) U3.B19(C:SDRC_D26) U3.B20(C:SDRC_D27) U3.B21(C:SDRC_D30) U3.B23(C:CAM_WEN) U3.B24(C:CAM_D2) U3.B25(C:CAM_D10) U3.B26(C:CAM_XCLKB) U3.B28(C:POP_B23_B28) U3.C1(A:SDRC_A8) U3.C2(A:SDRC_A7) U3.C3(A:SDRC_A6) U3.C4(A:SDRC_A4) U3.C5(A:SDRC_A3) U3.C6(A:SDRC_D1) U3.C8(A:SDRC_D3) U3.C9(A:SDRC_D4) U3.C11(C:SDRC_D18) U3.C12(C:SDRC_D20) U3.C14(C:SDRC_D8) U3.C15(C:SDRC_D10) U3.C17(C:SDRC_D13) U3.C18(C:SDRC_D24) U3.C20(C:SDRC_DM3) U3.C21(C:SDRC_D31) U3.C23(C:CAM_FLD) U3.C24(C:CAM_D3) U3.C25(C:CAM_XCLKA) U3.C26(C:CAM_D11) U3.C27(C:CAM_PCLK) U3.D1(A:SDRC_A12) U3.D2(A:SDRC_A11) U3.D3(A:SDRC_A10) U3.D4(A:SDRC_A9) U3.D5(A:SDRC_A5) U3.D6(A:SDRC_D0) U3.D11(C:SDRC_D16) U3.D12(C:SDRC_D19) U3.D14(C:SDRC_D23) U3.D17(C:SDRC_D12) U3.D18(C:SDRC_D15) U3.D20(C:SDRC_D28) U3.D24(C:CAM_D4) U3.D25(C:CAM_STROBE) U3.D26(C:DSS_HSYNC) U3.D27(C:DSS_VSYNC) U3.D28(C:DSS_PCLK) U3.E1(A:SDRC_A14) U3.E2(A:SDRC_A13) U3.E26(C:DSS_DATA6) U3.E27(C:DSS_ACBIAS) U3.E28(D:DSS_DATA20) U3.F27(D:DSS_DATA8) U3.F28(D:DSS_DATA7) U3.G1(A:NC) U3.G2(A:GPMC_NOE) U3.G3(A:GPMC_NBE0_DE) U3.G4(A:GPMC_NCS0) U3.G25(D:DSS_DATA16) U3.G26(D:DSS_DATA9) U3.H1(A:GPMC_NWP) U3.H2(A:GPMC_D8) U3.H3(A:GPM_NCS1) U3.H9(A:SDRC_BA0) U3.H10(D:SDRC_BA1) U3.H11(D:SDRC_NCS0) U3.H12(D:SDRC_NCS1) U3.H13(D:SDRC_NCAS) U3.H14(D:SDRC_NRAS) U3.H15(D:SDRC_NWE) U3.H16(D:SDRC_CKE0) U3.H17(D:SDRC_CKE1) U3.H18(D:UART3_CTS_RCTX) U3.H19(D:UART3_RTS_SD) U3.H20(D:UART3_RX_IRRX) U3.H21(D:UART3_TX_IRTX) U3.H25(D:DSS_DATA19) U3.H26(D:DSS_DATA18) U3.H27(D:DSS_DATA17) U3.J8(A:GPMC_WAIT3) U3.J21(D:I2C1_SDA) U3.J25(D:HDQ_SIO) U3.J26(D:DSS_DATA21) U3.J27(D:POP_H22_J27) U3.J28(D:POP_K1_J28) U3.K1(A:GPMC_D0) U3.K2(A:GPMC_D9) U3.K3(A:GPMC_A10) U3.K4(A:GPMC_A4) U3.K8(A:GPMC_WAIT2) U3.K21(D:I2C1_SCL) U3.K26(D:MCBSP1_FSX) U3.K27(D:CAM_D8) U3.K28(D:CAM_D6) U3.L1(A:GPMC_D1) U3.L2(A:GPMC_D2) U3.L3(A:GPMC_A9) U3.L4(A:GPMC_A3) U3.L8(A:GPMC_WAIT1) U3.L21(D:CAP_VDD_SRAM_CORE) U3.L25(D:CDD_CORE) U3.L27(D:CAM_D9) U3.L28(D:CAM_D7) U3.M1(A:POP_Y23_M1) U3.M2(A:POP_K2_M2) U3.M3(A:GPMC_A8) U3.M4(A:GPMC_A2) U3.M8(A:GPMC_WAIT0) U3.M21(D:MCBSP2_DX) U3.M26(D:POP_K22_M26) U3.M27(D:MMC1_CMD) U3.N1(A:POP_U1_N1) U3.N2(A:POP_I2_N2) U3.N3(A:GPMC_A7) U3.N4(A:GPMC_A1) U3.N8(A:GPMC_NCS7) U3.N21(D:MCBSP2_CLKX) U3.N25(D:MMC1_DAT2) U3.N26(D:MMC1_DAT1) U3.N27(D:MMC1_DA0) U3.N28(D:MMC1_CLK) U3.P1(A:GPMC_D10) U3.P2(A:GPMC_D3) U3.P8(B:GPMC_NCS6) U3.P21(D:MCBSP2_FSX) U3.P26(E:MMC1_DAT5) U3.P27(E:MMC1_DAT4) U3.P28(E:MMC1_DAT3) U3.R1(B:GPMC_D11) U3.R2(B:GPMC_D12) U3.R3(B:GPMC_A6) U3.R8(B:GPMC_NCS5) U3.R21(E:MCBSP2_DR) U3.R25(E:MMC1_DAT7) U3.R27(E:MMC1_DAT6) U3.R28(E:HSUSB0_DIR) U3.T1(B:GMC_D4) U3.T2(B:GPMC_D13) U3.T3(B:GPMC_A5) U3.T4(B:GPMC_CLK) U3.T8(B:GPMC_NCS4) U3.T21(E:MCBSP_CLKS) U3.T25(E:HSUSB0_STP) U3.T26(E:HSUSB0_NXT) U3.T27(E:HSUSB0_DATA0) U3.T28(E:HSUSB0_CLK) U3.U3(B:GPMC_NBE1) U3.U4(B:NC) U3.U8(B:GPMC_NCS3) U3.U21(E:MCBSP1_DR) U3.U25(E:HSUSB0_DATA4) U3.U26(E:HSUSB0_DATA3) U3.U27(E:HSUSB0_DATA2) U3.U28(E:HSUSB0_DATA1) U3.V1(B:GPMC_D5) U3.V2(B:GPMC_D6) U3.V3(B:MCSPI2_CS1) U3.V4(B:V4) U3.V8(B:GPMC_NCS2) U3.V21(E:MCBSP1_DX) U3.V26(E:HSUSB0_DATA7) U3.V27(E:HSUSB0_DATA6) U3.V28(E:HSUSB0_DATA5) U3.W1(B:GPMC_D14) U3.W2(B:GPMC_D7) U3.W8(B:UART1_CTS) U3.W21(E:MCBSP1_CLKX) U3.W26(E:TV_VREF) U3.W27(E:TV_VFB2) U3.W28(E:TV_OUT2) U3.Y1(B:GPMC_D15) U3.Y2(B:MCSPI2_SIMO) U3.Y3(B:MCSPI2_SOMI) U3.Y4(B:MCSPI2_CS0) U3.Y8(B:UART1_RX) U3.Y21(E:MCBSP1_CLKR) U3.Y27(E:TV_VFB1) U3.Y28(E:TV_OUT1)

## Sheet 4 of 6
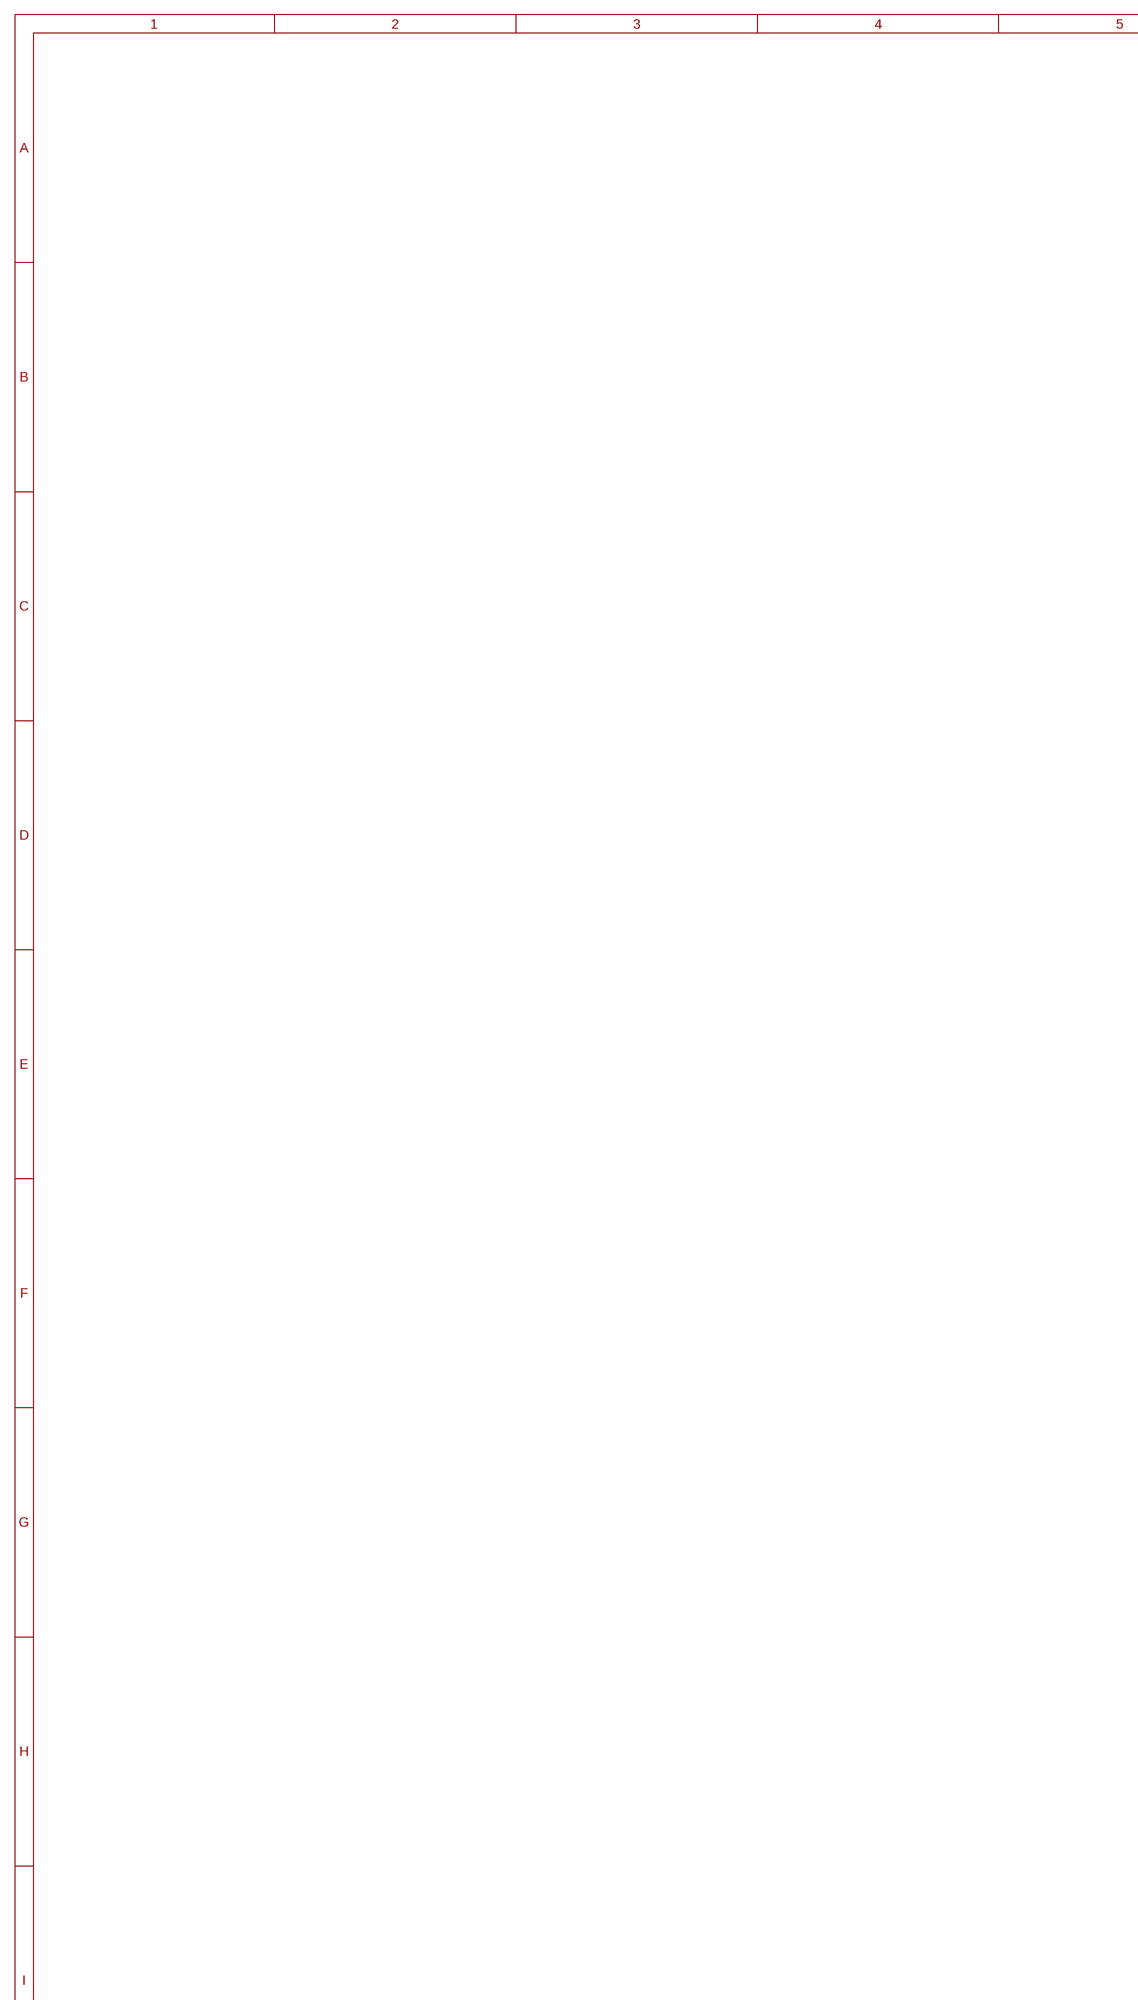
[diagram p6: schematic, sheet 4, part 1 of 2]
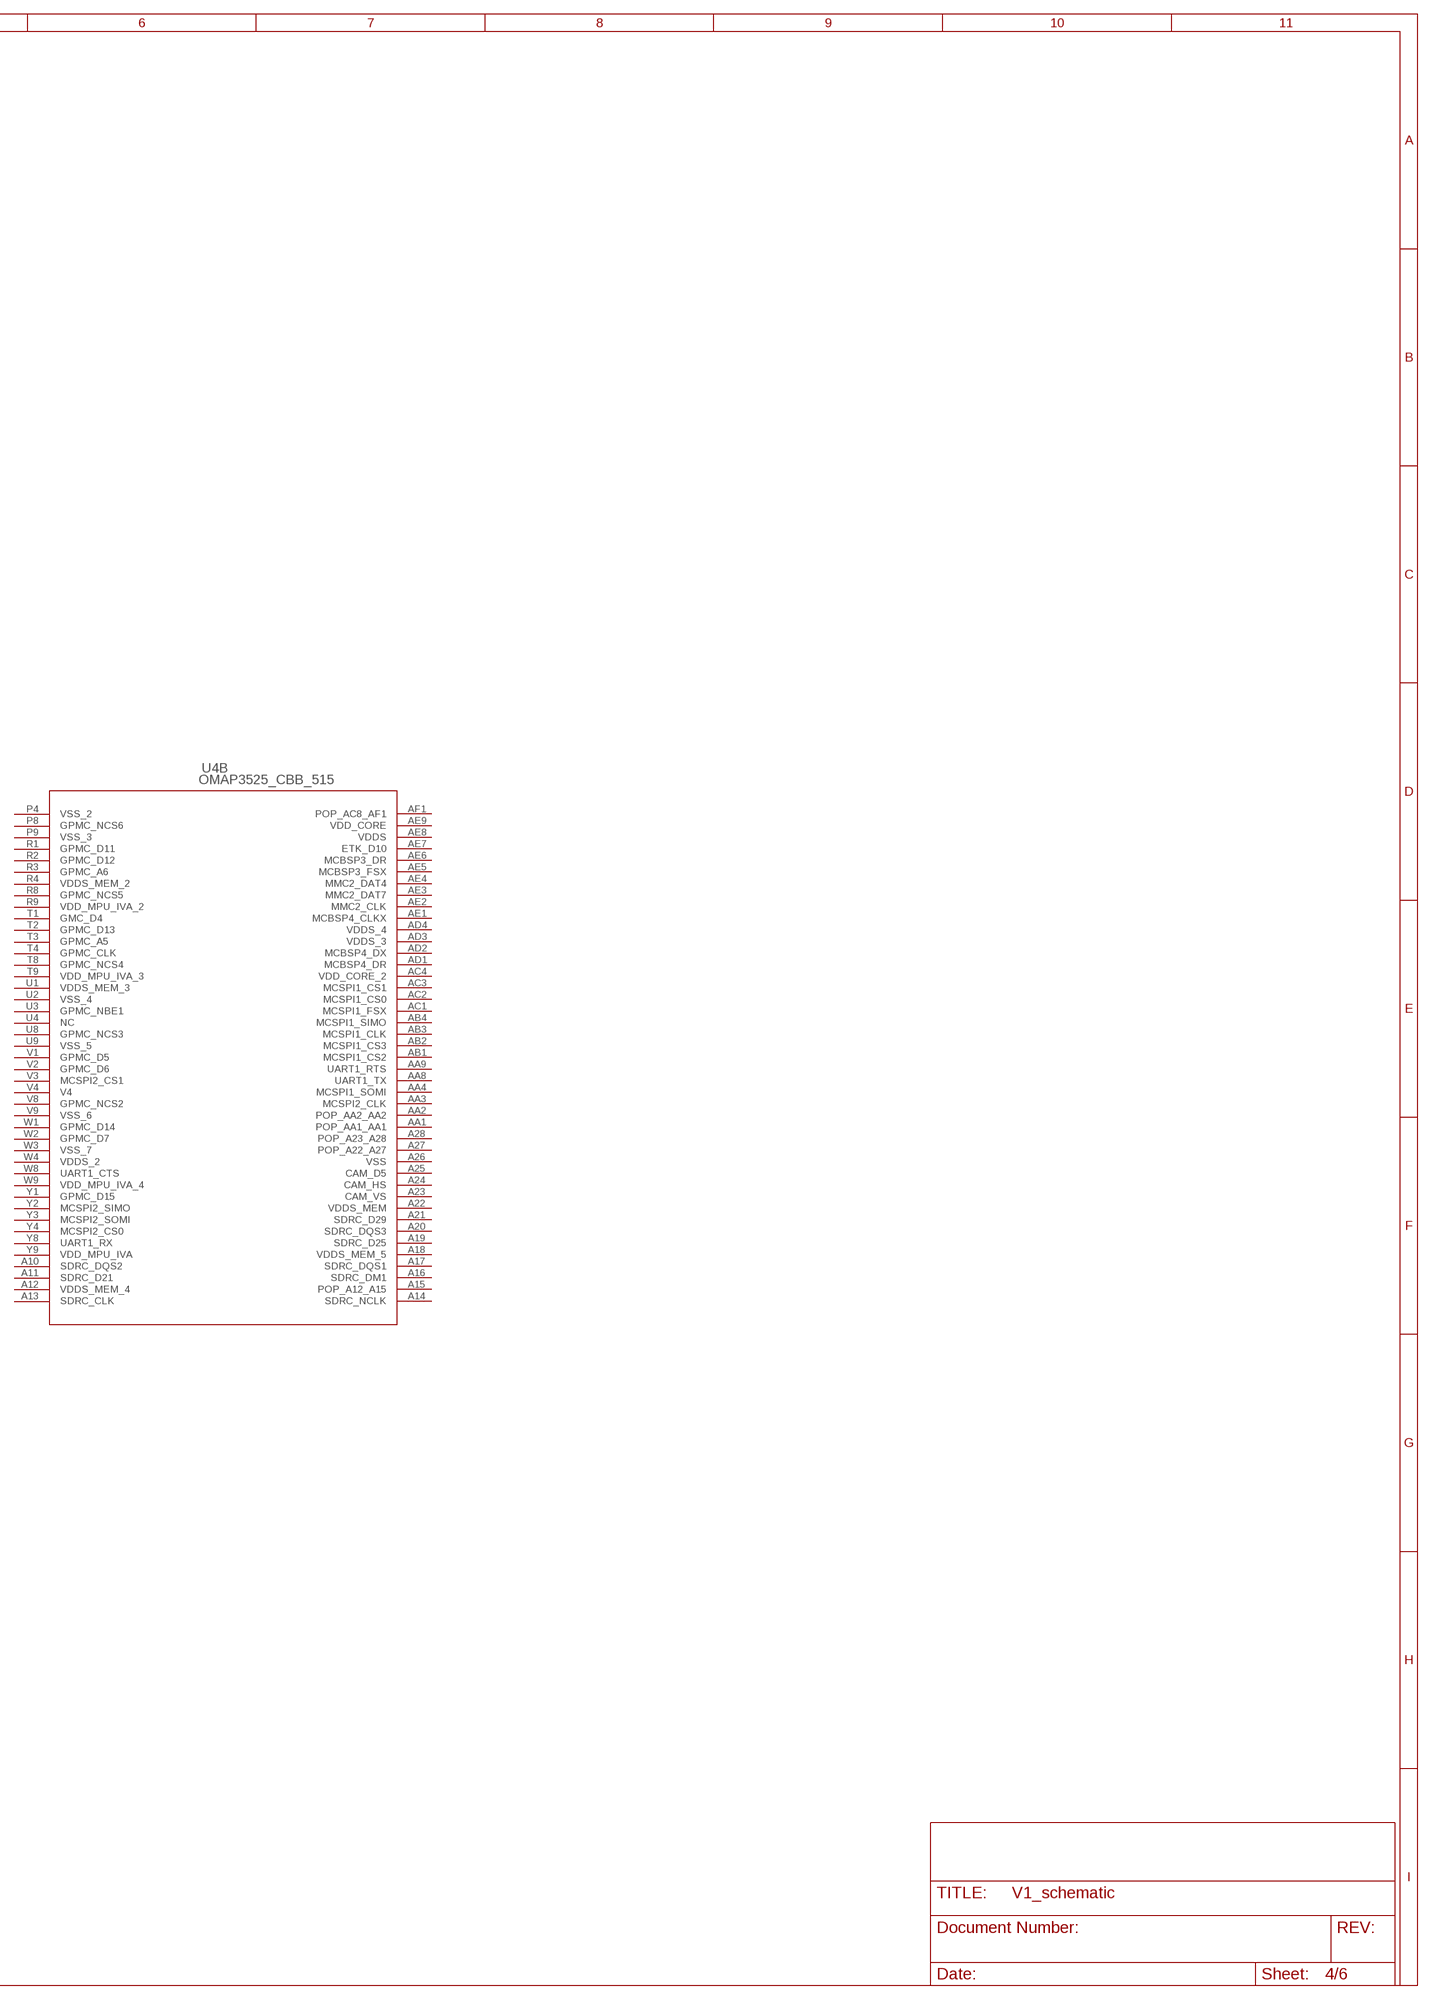
[diagram p7: schematic, sheet 4, part 2 of 2]

### Parts
U4  OMAP3525_CBB_515  [CBB515]
Unconnected: U4.A1(A:POP_A1_A1) U4.A2(A:POP_A2_A2) U4.A4(A:SDRC_A0) U4.A6(A:SDRC_DQS0) U4.A7(A:SDRC_D5) U4.A9(A:SDRC_D7) U4.A10(B:SDRC_DQS2) U4.A11(B:SDRC_D21) U4.A13(B:SDRC_CLK) U4.A14(B:SDRC_NCLK) U4.A15(B:POP_A12_A15) U4.A16(B:SDRC_DM1) U4.A17(B:SDRC_DQS1) U4.A19(B:SDRC_D25) U4.A20(B:SDRC_DQS3) U4.A21(B:SDRC_D29) U4.A23(B:CAM_VS) U4.A24(B:CAM_HS) U4.A25(B:CAM_D5) U4.A27(B:POP_A22_A27) U4.A28(B:POP_A23_A28) U4.AA1(B:POP_AA1_AA1) U4.AA2(B:POP_AA2_AA2) U4.AA3(B:MCSPI2_CLK) U4.AA4(B:MCSPI1_SOMI) U4.AA8(B:UART1_TX) U4.AA9(B:UART1_RTS) U4.AA10(E:JTAG_EMU1) U4.AA11(E:JTAG_EMU0) U4.AA12(E:JTAG_RTCK) U4.AA13(E:JTAG_TCK) U4.AA15(E:CAP_VDD_WKUP) U4.AA17(E:JTAG_NTRST) U4.AA18(E:JTAG_TMS_TMSC) U4.AA19(E:JTAG_TDO) U4.AA20(E:JTAG_TDI) U4.AA21(E:MCBSP1_FSR) U4.AA25(E:UART2_TX) U4.AA27(E:DSS_DATA15) U4.AA28(E:DSS_DATA14) U4.AB1(B:MCSPI1_CS2) U4.AB2(B:MCSPI1_CS3) U4.AB3(B:MCSPI1_CLK) U4.AB4(B:MCSPI1_SIMO) U4.AB25(E:UART2_RTS) U4.AB26(E:UART2_CTS) U4.AB27(E:DSS_DATA13) U4.AB28(F:DSS_DATA12) U4.AC1(B:MCSPI1_FSX) U4.AC2(B:MCSPI1_CS0) U4.AC3(B:MCSPI1_CS1) U4.AC27(F:DSS_DATA22) U4.AC28(F:DSS_DATA23) U4.AD1(B:MCBSP4_DR) U4.AD2(B:MCBSP4_DX) U4.AD25(F:UART2_RX) U4.AD26(F:I2C4_SCL) U4.AD27(F:DSS_DATA11) U4.AD28(F:DSS_DATA10) U4.AE1(B:MCBSP4_CLKX) U4.AE2(B:MMC2_CLK) U4.AE3(B:MMC2_DAT7) U4.AE4(B:MMC2_DAT4) U4.AE5(B:MCBSP3_FSX) U4.AE6(B:MCBSP3_DR) U4.AE7(B:ETK_D10) U4.AE10(F:ETK_CTL) U4.AE11(F:ETK_D4) U4.AE13(F:ETK_D3) U4.AE14(F:SYS_BOOT2) U4.AE15(F:I2C2_SDA) U4.AE17(F:SYS_XTALIN) U4.AE21(F:SYS_BOOT5) U4.AE22(F:SYS_CLKOUT2) U4.AE25(F:SYS_32K) U4.AE26(F:I2C4_SDA) U4.AE28(F:POP_AA23_AE28) U4.AF1(B:POP_AC8_AF1) U4.AF2(C:POP_U2_AF2) U4.AF3(C:MMC2_DAT6) U4.AF4(C:MMC2_DAT3) U4.AF5(C:MCBSP3_CLKX) U4.AF6(C:MCBSP3_DX) U4.AF7(C:ETK_D11) U4.AF9(C:ETK_D8) U4.AF10(F:ETK_CLK) U4.AF11(F:ETK_D0) U4.AF13(F:ETK_D6) U4.AF14(F:I2C3_SCL) U4.AF15(F:I2C2_SCL) U4.AF17(F:SYS_XTALOUT) U4.AF18(F:SYS_BOOT3) U4.AF19(F:SYS_BOOT4) U4.AF21(F:SYS_BOOT6) U4.AF22(F:SYS_OFF_MODE) U4.AF24(F:SYS_NRESWARM) U4.AF25(F:SYS_CLKREQ) U4.AF26(F:SYS_NIRQ) U4.AF27(F:POP_AA22_AF27) U4.AF28(F:POP_H23_AF28) U4.AG1(C:POP_AB1_AG1) U4.AG4(C:MMC2_DAT2) U4.AG5(C:MMC2_CMD) U4.AG7(C:ETK_D12) U4.AG8(C:ETK_D14) U4.AG9(C:ETK_D9) U4.AG10(F:POP_AB8_AG10) U4.AG11(F:POP_AB9_AG11) U4.AG12(F:ETK_D1) U4.AG13(F:POP_AB11_AG13) U4.AG14(F:I2C3_SDA) U4.AG15(F:POP_AB13_AG15) U4.AG17(F:CAM_D0) U4.AG18(F:GPIO_114) U4.AG19(F:GPIO_112) U4.AG22(F:DSS_DATA0) U4.AG23(F:DSS_DATA2) U4.AG24(F:DSS_DATA4) U4.AG25(F:SYS_CLKOUT1) U4.AG26(F:SYS_BOOT1) U4.AG28(F:POP_AB23_AG28) U4.AH1(C:POP_AC1_AH1) U4.AH2(C:POP_AC2_AH2) U4.AH3(C:MMC2_DAT5) U4.AH4(C:MMC2_DAT1) U4.AH5(C:MMC2_DAT0) U4.AH7(C:ETK_D13) U4.AH8(C:ETK_D15) U4.AH9(C:ETK_D5) U4.AH10(F:POP_AC13_AH10) U4.AH11(F:POP_AC9_AH11) U4.AH12(F:ETK_D2) U4.AH13(F:POP_AC11_AH13) U4.AH14(F:ETK_D7) U4.AH15(F:POP_I1_AH15) U4.AH16(F:POP_AC14_AH16) U4.AH17(F:CAM_D1) U4.AH18(F:GPIO_115) U4.AH19(F:GPIO_113) U4.AH20(F:CAP_VDD_D) U4.AH22(F:DSS_DATA1) U4.AH23(F:DSS_DATA3) U4.AH24(F:DSS_DATA5) U4.AH25(F:SYS_NRESPWRON) U4.AH26(F:SYS_BOOT0) U4.AH27(F:POP_AC22_AH27) U4.AH28(F:POP_AC23_AH28) U4.B1(A:POP_B1_B1) U4.B3(A:SDRC_A2) U4.B4(A:SDRC_A1) U4.B6(A:SDRC_D21) U4.B7(A:SDRC_DM0) U4.B9(A:SDRC_A6_2) U4.B10(C:SDRC_D17) U4.B11(C:SDRC_DM2) U4.B13(C:SDRC_D22) U4.B14(C:SDRC_D9) U4.B15(C:POP_B12_B15) U4.B16(C:SDRC_D11) U4.B17(C:SDRC_D14) U4.B19(C:SDRC_D26) U4.B20(C:SDRC_D27) U4.B21(C:SDRC_D30) U4.B23(C:CAM_WEN) U4.B24(C:CAM_D2) U4.B25(C:CAM_D10) U4.B26(C:CAM_XCLKB) U4.B28(C:POP_B23_B28) U4.C1(A:SDRC_A8) U4.C2(A:SDRC_A7) U4.C3(A:SDRC_A6) U4.C4(A:SDRC_A4) U4.C5(A:SDRC_A3) U4.C6(A:SDRC_D1) U4.C8(A:SDRC_D3) U4.C9(A:SDRC_D4) U4.C11(C:SDRC_D18) U4.C12(C:SDRC_D20) U4.C14(C:SDRC_D8) U4.C15(C:SDRC_D10) U4.C17(C:SDRC_D13) U4.C18(C:SDRC_D24) U4.C20(C:SDRC_DM3) U4.C21(C:SDRC_D31) U4.C23(C:CAM_FLD) U4.C24(C:CAM_D3) U4.C25(C:CAM_XCLKA) U4.C26(C:CAM_D11) U4.C27(C:CAM_PCLK) U4.D1(A:SDRC_A12) U4.D2(A:SDRC_A11) U4.D3(A:SDRC_A10) U4.D4(A:SDRC_A9) U4.D5(A:SDRC_A5) U4.D6(A:SDRC_D0) U4.D11(C:SDRC_D16) U4.D12(C:SDRC_D19) U4.D14(C:SDRC_D23) U4.D17(C:SDRC_D12) U4.D18(C:SDRC_D15) U4.D20(C:SDRC_D28) U4.D24(C:CAM_D4) U4.D25(C:CAM_STROBE) U4.D26(C:DSS_HSYNC) U4.D27(C:DSS_VSYNC) U4.D28(C:DSS_PCLK) U4.E1(A:SDRC_A14) U4.E2(A:SDRC_A13) U4.E26(C:DSS_DATA6) U4.E27(C:DSS_ACBIAS) U4.E28(D:DSS_DATA20) U4.F27(D:DSS_DATA8) U4.F28(D:DSS_DATA7) U4.G1(A:NC) U4.G2(A:GPMC_NOE) U4.G3(A:GPMC_NBE0_DE) U4.G4(A:GPMC_NCS0) U4.G25(D:DSS_DATA16) U4.G26(D:DSS_DATA9) U4.H1(A:GPMC_NWP) U4.H2(A:GPMC_D8) U4.H3(A:GPM_NCS1) U4.H9(A:SDRC_BA0) U4.H10(D:SDRC_BA1) U4.H11(D:SDRC_NCS0) U4.H12(D:SDRC_NCS1) U4.H13(D:SDRC_NCAS) U4.H14(D:SDRC_NRAS) U4.H15(D:SDRC_NWE) U4.H16(D:SDRC_CKE0) U4.H17(D:SDRC_CKE1) U4.H18(D:UART3_CTS_RCTX) U4.H19(D:UART3_RTS_SD) U4.H20(D:UART3_RX_IRRX) U4.H21(D:UART3_TX_IRTX) U4.H25(D:DSS_DATA19) U4.H26(D:DSS_DATA18) U4.H27(D:DSS_DATA17) U4.J8(A:GPMC_WAIT3) U4.J21(D:I2C1_SDA) U4.J25(D:HDQ_SIO) U4.J26(D:DSS_DATA21) U4.J27(D:POP_H22_J27) U4.J28(D:POP_K1_J28) U4.K1(A:GPMC_D0) U4.K2(A:GPMC_D9) U4.K3(A:GPMC_A10) U4.K4(A:GPMC_A4) U4.K8(A:GPMC_WAIT2) U4.K21(D:I2C1_SCL) U4.K26(D:MCBSP1_FSX) U4.K27(D:CAM_D8) U4.K28(D:CAM_D6) U4.L1(A:GPMC_D1) U4.L2(A:GPMC_D2) U4.L3(A:GPMC_A9) U4.L4(A:GPMC_A3) U4.L8(A:GPMC_WAIT1) U4.L21(D:CAP_VDD_SRAM_CORE) U4.L25(D:CDD_CORE) U4.L27(D:CAM_D9) U4.L28(D:CAM_D7) U4.M1(A:POP_Y23_M1) U4.M2(A:POP_K2_M2) U4.M3(A:GPMC_A8) U4.M4(A:GPMC_A2) U4.M8(A:GPMC_WAIT0) U4.M21(D:MCBSP2_DX) U4.M26(D:POP_K22_M26) U4.M27(D:MMC1_CMD) U4.N1(A:POP_U1_N1) U4.N2(A:POP_I2_N2) U4.N3(A:GPMC_A7) U4.N4(A:GPMC_A1) U4.N8(A:GPMC_NCS7) U4.N21(D:MCBSP2_CLKX) U4.N25(D:MMC1_DAT2) U4.N26(D:MMC1_DAT1) U4.N27(D:MMC1_DA0) U4.N28(D:MMC1_CLK) U4.P1(A:GPMC_D10) U4.P2(A:GPMC_D3) U4.P8(B:GPMC_NCS6) U4.P21(D:MCBSP2_FSX) U4.P26(E:MMC1_DAT5) U4.P27(E:MMC1_DAT4) U4.P28(E:MMC1_DAT3) U4.R1(B:GPMC_D11) U4.R2(B:GPMC_D12) U4.R3(B:GPMC_A6) U4.R8(B:GPMC_NCS5) U4.R21(E:MCBSP2_DR) U4.R25(E:MMC1_DAT7) U4.R27(E:MMC1_DAT6) U4.R28(E:HSUSB0_DIR) U4.T1(B:GMC_D4) U4.T2(B:GPMC_D13) U4.T3(B:GPMC_A5) U4.T4(B:GPMC_CLK) U4.T8(B:GPMC_NCS4) U4.T21(E:MCBSP_CLKS) U4.T25(E:HSUSB0_STP) U4.T26(E:HSUSB0_NXT) U4.T27(E:HSUSB0_DATA0) U4.T28(E:HSUSB0_CLK) U4.U3(B:GPMC_NBE1) U4.U4(B:NC) U4.U8(B:GPMC_NCS3) U4.U21(E:MCBSP1_DR) U4.U25(E:HSUSB0_DATA4) U4.U26(E:HSUSB0_DATA3) U4.U27(E:HSUSB0_DATA2) U4.U28(E:HSUSB0_DATA1) U4.V1(B:GPMC_D5) U4.V2(B:GPMC_D6) U4.V3(B:MCSPI2_CS1) U4.V4(B:V4) U4.V8(B:GPMC_NCS2) U4.V21(E:MCBSP1_DX) U4.V26(E:HSUSB0_DATA7) U4.V27(E:HSUSB0_DATA6) U4.V28(E:HSUSB0_DATA5) U4.W1(B:GPMC_D14) U4.W2(B:GPMC_D7) U4.W8(B:UART1_CTS) U4.W21(E:MCBSP1_CLKX) U4.W26(E:TV_VREF) U4.W27(E:TV_VFB2) U4.W28(E:TV_OUT2) U4.Y1(B:GPMC_D15) U4.Y2(B:MCSPI2_SIMO) U4.Y3(B:MCSPI2_SOMI) U4.Y4(B:MCSPI2_CS0) U4.Y8(B:UART1_RX) U4.Y21(E:MCBSP1_CLKR) U4.Y27(E:TV_VFB1) U4.Y28(E:TV_OUT1)

## Sheet 5 of 6
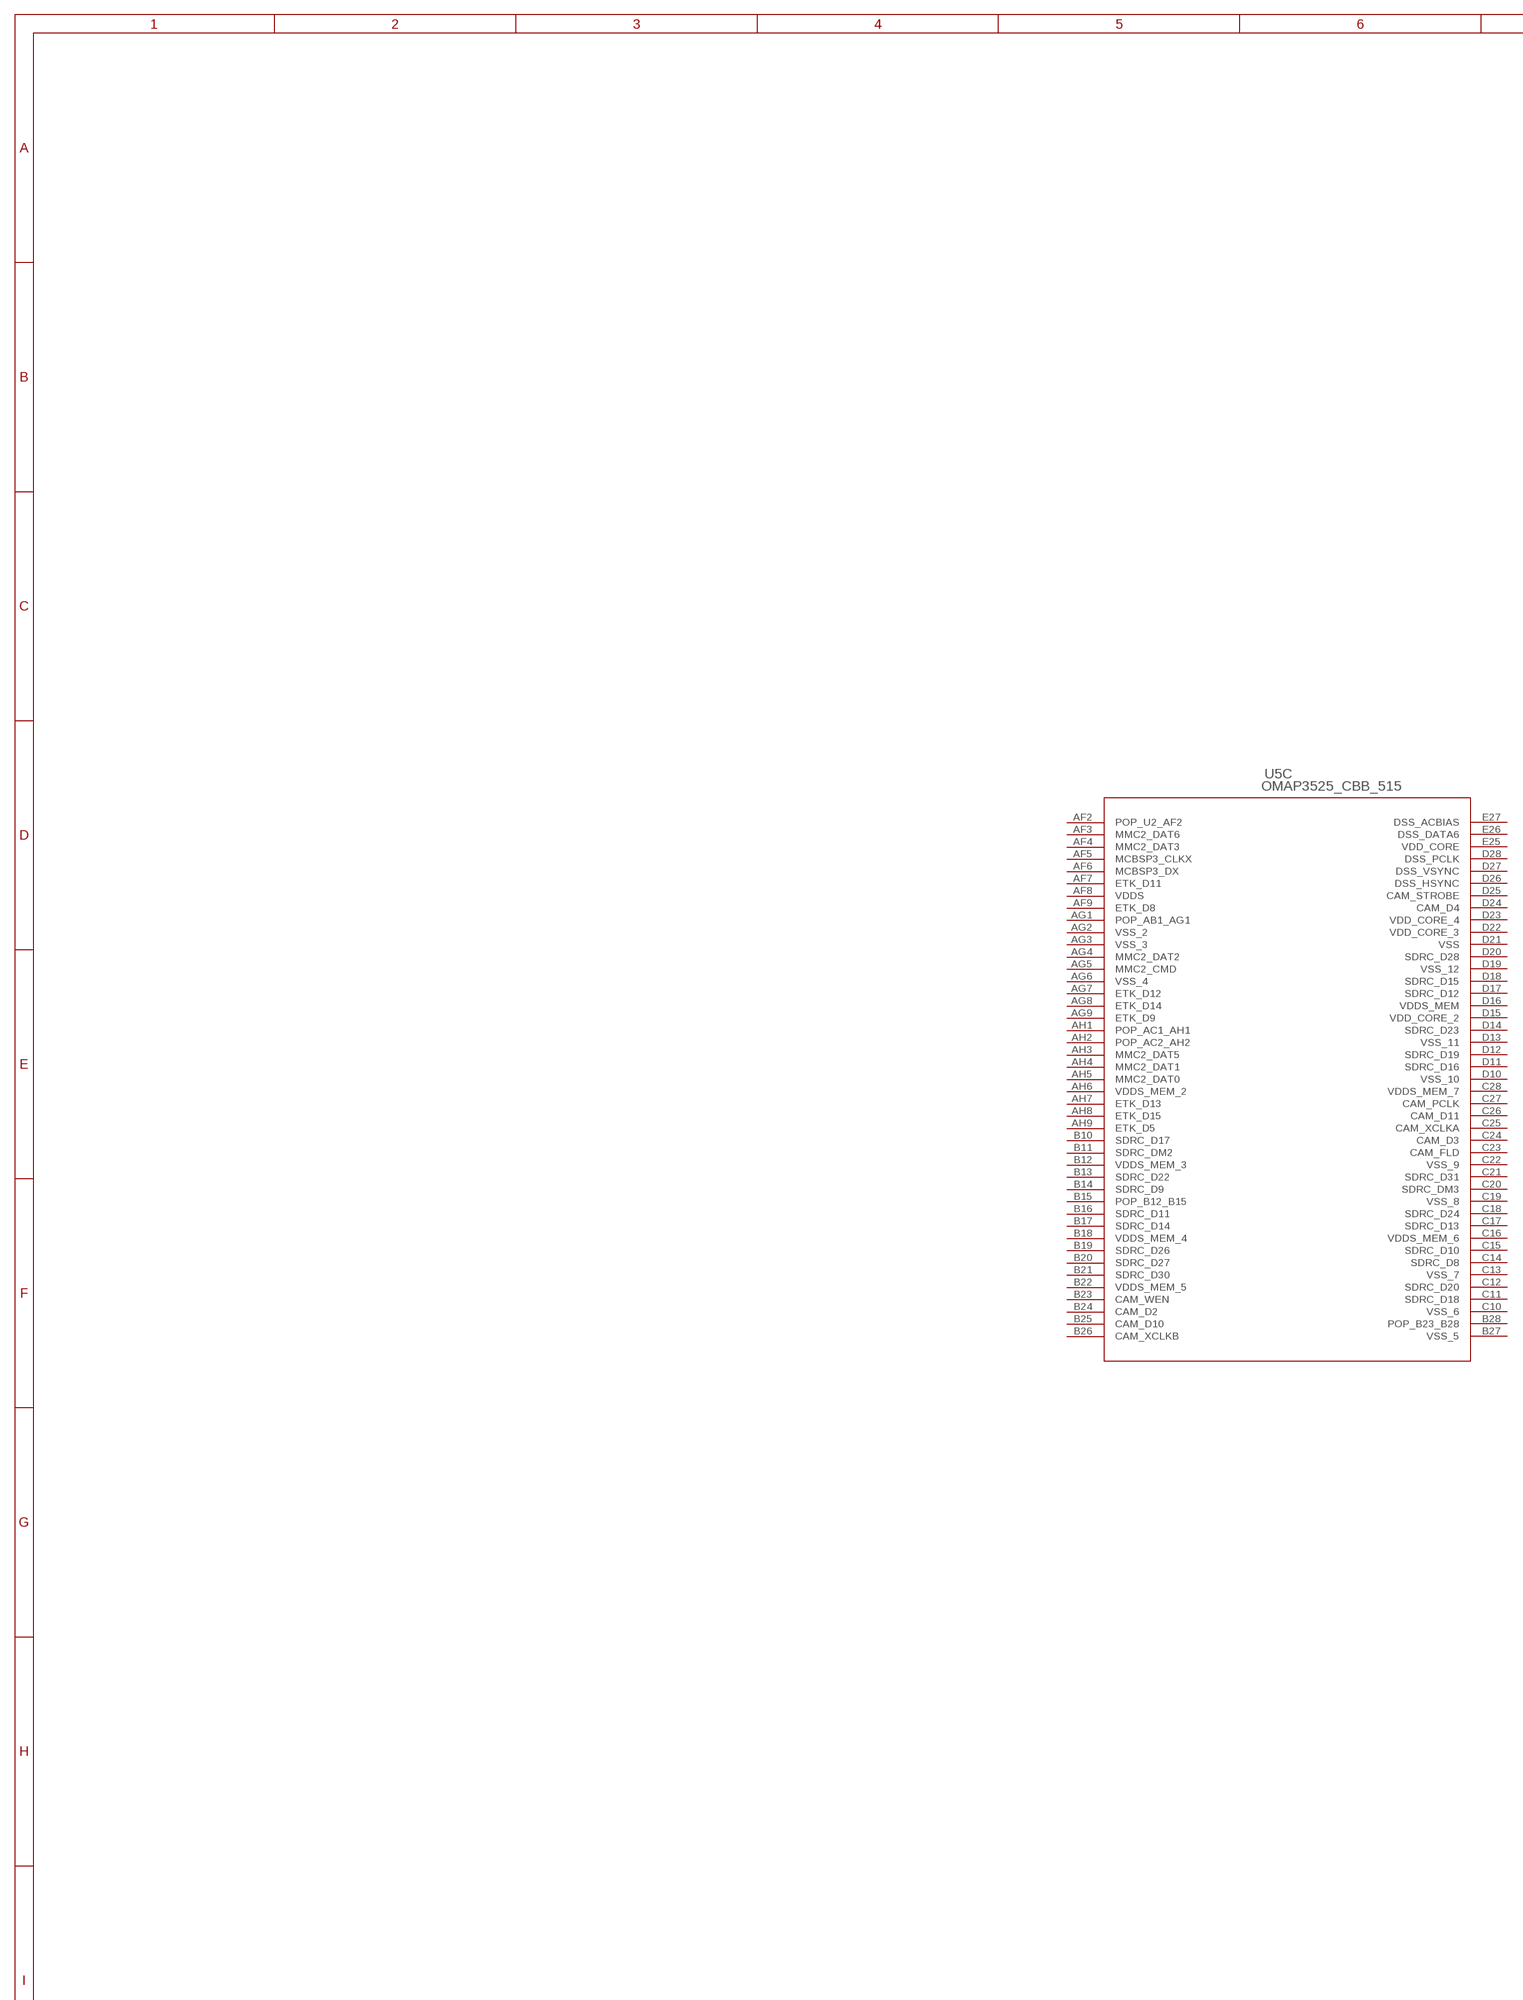
[diagram p8: schematic, sheet 5, part 1 of 2]
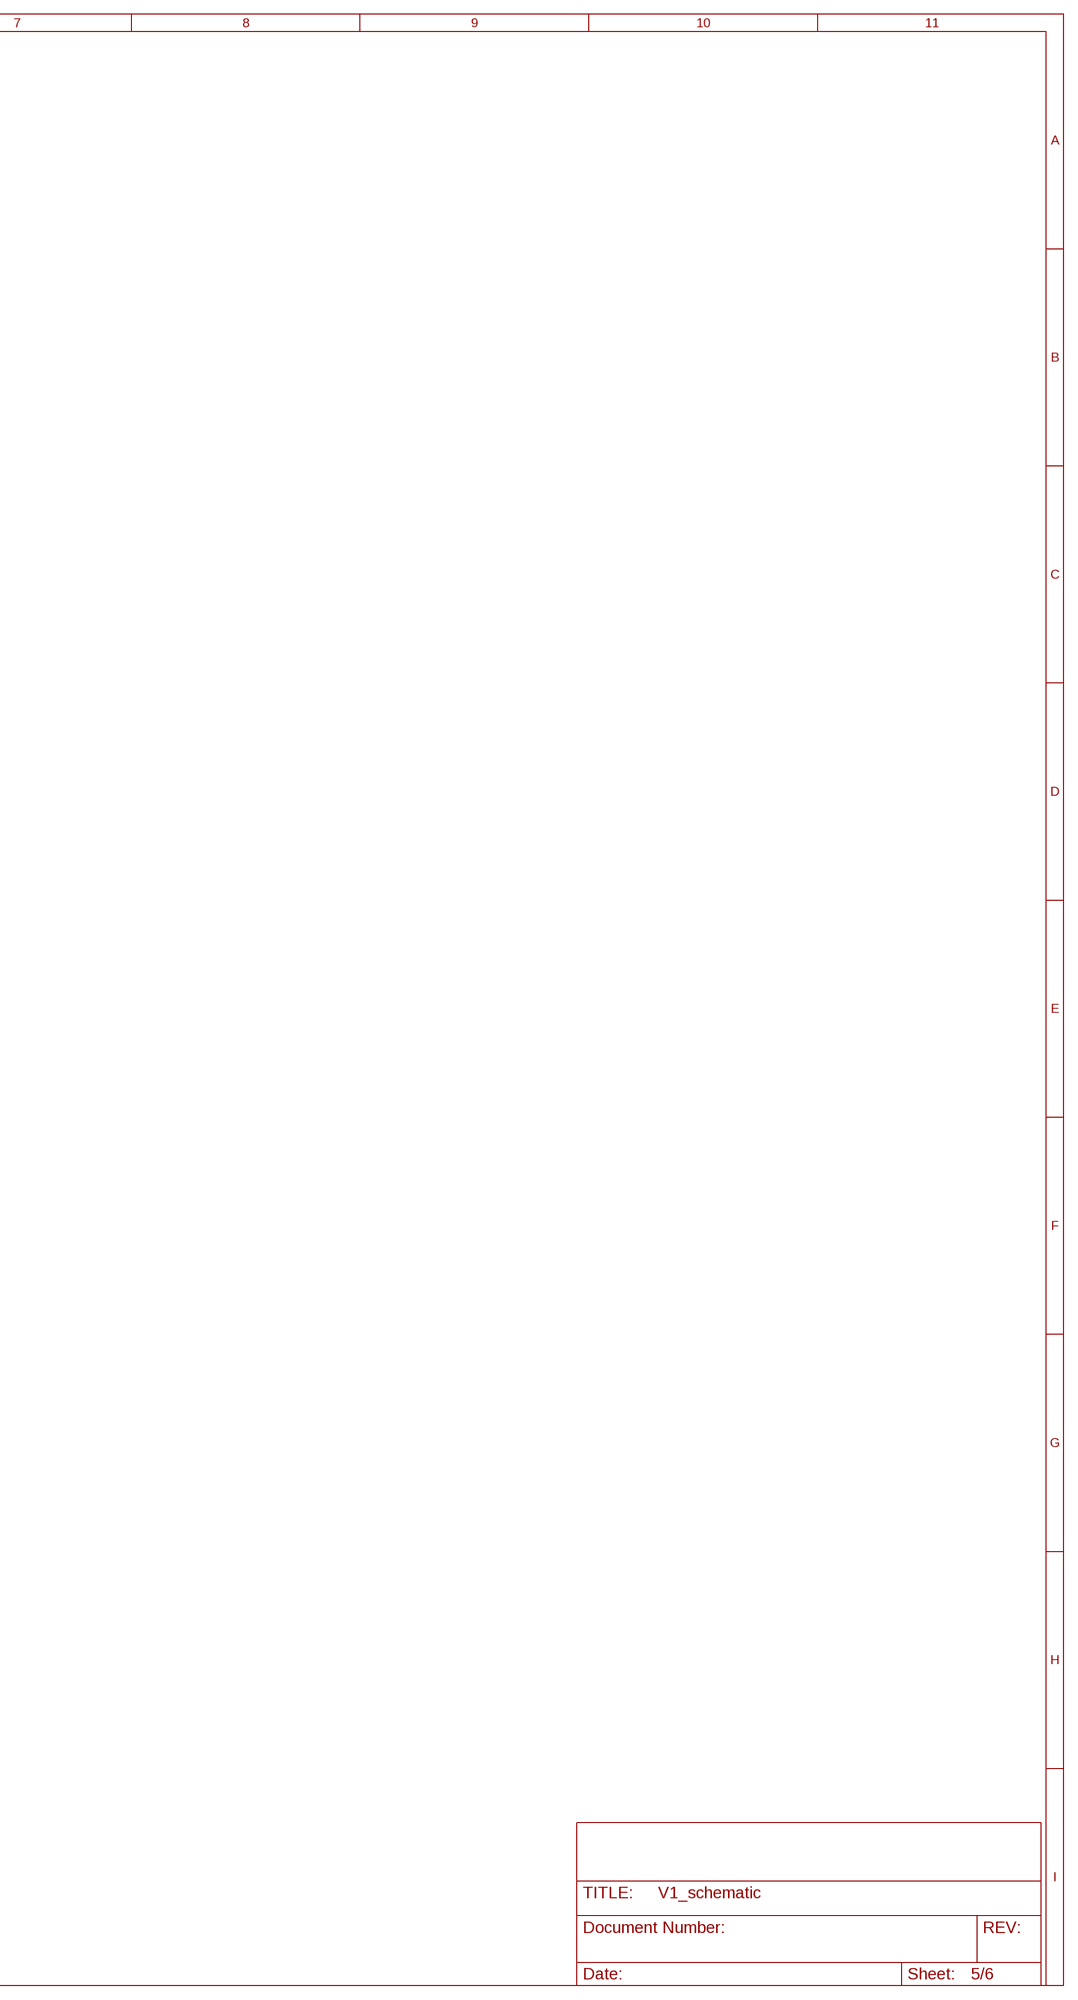
[diagram p9: schematic, sheet 5, part 2 of 2]

### Parts
U5  OMAP3525_CBB_515  [CBB515]
Unconnected: U5.A1(A:POP_A1_A1) U5.A2(A:POP_A2_A2) U5.A4(A:SDRC_A0) U5.A6(A:SDRC_DQS0) U5.A7(A:SDRC_D5) U5.A9(A:SDRC_D7) U5.A10(B:SDRC_DQS2) U5.A11(B:SDRC_D21) U5.A13(B:SDRC_CLK) U5.A14(B:SDRC_NCLK) U5.A15(B:POP_A12_A15) U5.A16(B:SDRC_DM1) U5.A17(B:SDRC_DQS1) U5.A19(B:SDRC_D25) U5.A20(B:SDRC_DQS3) U5.A21(B:SDRC_D29) U5.A23(B:CAM_VS) U5.A24(B:CAM_HS) U5.A25(B:CAM_D5) U5.A27(B:POP_A22_A27) U5.A28(B:POP_A23_A28) U5.AA1(B:POP_AA1_AA1) U5.AA2(B:POP_AA2_AA2) U5.AA3(B:MCSPI2_CLK) U5.AA4(B:MCSPI1_SOMI) U5.AA8(B:UART1_TX) U5.AA9(B:UART1_RTS) U5.AA10(E:JTAG_EMU1) U5.AA11(E:JTAG_EMU0) U5.AA12(E:JTAG_RTCK) U5.AA13(E:JTAG_TCK) U5.AA15(E:CAP_VDD_WKUP) U5.AA17(E:JTAG_NTRST) U5.AA18(E:JTAG_TMS_TMSC) U5.AA19(E:JTAG_TDO) U5.AA20(E:JTAG_TDI) U5.AA21(E:MCBSP1_FSR) U5.AA25(E:UART2_TX) U5.AA27(E:DSS_DATA15) U5.AA28(E:DSS_DATA14) U5.AB1(B:MCSPI1_CS2) U5.AB2(B:MCSPI1_CS3) U5.AB3(B:MCSPI1_CLK) U5.AB4(B:MCSPI1_SIMO) U5.AB25(E:UART2_RTS) U5.AB26(E:UART2_CTS) U5.AB27(E:DSS_DATA13) U5.AB28(F:DSS_DATA12) U5.AC1(B:MCSPI1_FSX) U5.AC2(B:MCSPI1_CS0) U5.AC3(B:MCSPI1_CS1) U5.AC27(F:DSS_DATA22) U5.AC28(F:DSS_DATA23) U5.AD1(B:MCBSP4_DR) U5.AD2(B:MCBSP4_DX) U5.AD25(F:UART2_RX) U5.AD26(F:I2C4_SCL) U5.AD27(F:DSS_DATA11) U5.AD28(F:DSS_DATA10) U5.AE1(B:MCBSP4_CLKX) U5.AE2(B:MMC2_CLK) U5.AE3(B:MMC2_DAT7) U5.AE4(B:MMC2_DAT4) U5.AE5(B:MCBSP3_FSX) U5.AE6(B:MCBSP3_DR) U5.AE7(B:ETK_D10) U5.AE10(F:ETK_CTL) U5.AE11(F:ETK_D4) U5.AE13(F:ETK_D3) U5.AE14(F:SYS_BOOT2) U5.AE15(F:I2C2_SDA) U5.AE17(F:SYS_XTALIN) U5.AE21(F:SYS_BOOT5) U5.AE22(F:SYS_CLKOUT2) U5.AE25(F:SYS_32K) U5.AE26(F:I2C4_SDA) U5.AE28(F:POP_AA23_AE28) U5.AF1(B:POP_AC8_AF1) U5.AF2(C:POP_U2_AF2) U5.AF3(C:MMC2_DAT6) U5.AF4(C:MMC2_DAT3) U5.AF5(C:MCBSP3_CLKX) U5.AF6(C:MCBSP3_DX) U5.AF7(C:ETK_D11) U5.AF9(C:ETK_D8) U5.AF10(F:ETK_CLK) U5.AF11(F:ETK_D0) U5.AF13(F:ETK_D6) U5.AF14(F:I2C3_SCL) U5.AF15(F:I2C2_SCL) U5.AF17(F:SYS_XTALOUT) U5.AF18(F:SYS_BOOT3) U5.AF19(F:SYS_BOOT4) U5.AF21(F:SYS_BOOT6) U5.AF22(F:SYS_OFF_MODE) U5.AF24(F:SYS_NRESWARM) U5.AF25(F:SYS_CLKREQ) U5.AF26(F:SYS_NIRQ) U5.AF27(F:POP_AA22_AF27) U5.AF28(F:POP_H23_AF28) U5.AG1(C:POP_AB1_AG1) U5.AG4(C:MMC2_DAT2) U5.AG5(C:MMC2_CMD) U5.AG7(C:ETK_D12) U5.AG8(C:ETK_D14) U5.AG9(C:ETK_D9) U5.AG10(F:POP_AB8_AG10) U5.AG11(F:POP_AB9_AG11) U5.AG12(F:ETK_D1) U5.AG13(F:POP_AB11_AG13) U5.AG14(F:I2C3_SDA) U5.AG15(F:POP_AB13_AG15) U5.AG17(F:CAM_D0) U5.AG18(F:GPIO_114) U5.AG19(F:GPIO_112) U5.AG22(F:DSS_DATA0) U5.AG23(F:DSS_DATA2) U5.AG24(F:DSS_DATA4) U5.AG25(F:SYS_CLKOUT1) U5.AG26(F:SYS_BOOT1) U5.AG28(F:POP_AB23_AG28) U5.AH1(C:POP_AC1_AH1) U5.AH2(C:POP_AC2_AH2) U5.AH3(C:MMC2_DAT5) U5.AH4(C:MMC2_DAT1) U5.AH5(C:MMC2_DAT0) U5.AH7(C:ETK_D13) U5.AH8(C:ETK_D15) U5.AH9(C:ETK_D5) U5.AH10(F:POP_AC13_AH10) U5.AH11(F:POP_AC9_AH11) U5.AH12(F:ETK_D2) U5.AH13(F:POP_AC11_AH13) U5.AH14(F:ETK_D7) U5.AH15(F:POP_I1_AH15) U5.AH16(F:POP_AC14_AH16) U5.AH17(F:CAM_D1) U5.AH18(F:GPIO_115) U5.AH19(F:GPIO_113) U5.AH20(F:CAP_VDD_D) U5.AH22(F:DSS_DATA1) U5.AH23(F:DSS_DATA3) U5.AH24(F:DSS_DATA5) U5.AH25(F:SYS_NRESPWRON) U5.AH26(F:SYS_BOOT0) U5.AH27(F:POP_AC22_AH27) U5.AH28(F:POP_AC23_AH28) U5.B1(A:POP_B1_B1) U5.B3(A:SDRC_A2) U5.B4(A:SDRC_A1) U5.B6(A:SDRC_D21) U5.B7(A:SDRC_DM0) U5.B9(A:SDRC_A6_2) U5.B10(C:SDRC_D17) U5.B11(C:SDRC_DM2) U5.B13(C:SDRC_D22) U5.B14(C:SDRC_D9) U5.B15(C:POP_B12_B15) U5.B16(C:SDRC_D11) U5.B17(C:SDRC_D14) U5.B19(C:SDRC_D26) U5.B20(C:SDRC_D27) U5.B21(C:SDRC_D30) U5.B23(C:CAM_WEN) U5.B24(C:CAM_D2) U5.B25(C:CAM_D10) U5.B26(C:CAM_XCLKB) U5.B28(C:POP_B23_B28) U5.C1(A:SDRC_A8) U5.C2(A:SDRC_A7) U5.C3(A:SDRC_A6) U5.C4(A:SDRC_A4) U5.C5(A:SDRC_A3) U5.C6(A:SDRC_D1) U5.C8(A:SDRC_D3) U5.C9(A:SDRC_D4) U5.C11(C:SDRC_D18) U5.C12(C:SDRC_D20) U5.C14(C:SDRC_D8) U5.C15(C:SDRC_D10) U5.C17(C:SDRC_D13) U5.C18(C:SDRC_D24) U5.C20(C:SDRC_DM3) U5.C21(C:SDRC_D31) U5.C23(C:CAM_FLD) U5.C24(C:CAM_D3) U5.C25(C:CAM_XCLKA) U5.C26(C:CAM_D11) U5.C27(C:CAM_PCLK) U5.D1(A:SDRC_A12) U5.D2(A:SDRC_A11) U5.D3(A:SDRC_A10) U5.D4(A:SDRC_A9) U5.D5(A:SDRC_A5) U5.D6(A:SDRC_D0) U5.D11(C:SDRC_D16) U5.D12(C:SDRC_D19) U5.D14(C:SDRC_D23) U5.D17(C:SDRC_D12) U5.D18(C:SDRC_D15) U5.D20(C:SDRC_D28) U5.D24(C:CAM_D4) U5.D25(C:CAM_STROBE) U5.D26(C:DSS_HSYNC) U5.D27(C:DSS_VSYNC) U5.D28(C:DSS_PCLK) U5.E1(A:SDRC_A14) U5.E2(A:SDRC_A13) U5.E26(C:DSS_DATA6) U5.E27(C:DSS_ACBIAS) U5.E28(D:DSS_DATA20) U5.F27(D:DSS_DATA8) U5.F28(D:DSS_DATA7) U5.G1(A:NC) U5.G2(A:GPMC_NOE) U5.G3(A:GPMC_NBE0_DE) U5.G4(A:GPMC_NCS0) U5.G25(D:DSS_DATA16) U5.G26(D:DSS_DATA9) U5.H1(A:GPMC_NWP) U5.H2(A:GPMC_D8) U5.H3(A:GPM_NCS1) U5.H9(A:SDRC_BA0) U5.H10(D:SDRC_BA1) U5.H11(D:SDRC_NCS0) U5.H12(D:SDRC_NCS1) U5.H13(D:SDRC_NCAS) U5.H14(D:SDRC_NRAS) U5.H15(D:SDRC_NWE) U5.H16(D:SDRC_CKE0) U5.H17(D:SDRC_CKE1) U5.H18(D:UART3_CTS_RCTX) U5.H19(D:UART3_RTS_SD) U5.H20(D:UART3_RX_IRRX) U5.H21(D:UART3_TX_IRTX) U5.H25(D:DSS_DATA19) U5.H26(D:DSS_DATA18) U5.H27(D:DSS_DATA17) U5.J8(A:GPMC_WAIT3) U5.J21(D:I2C1_SDA) U5.J25(D:HDQ_SIO) U5.J26(D:DSS_DATA21) U5.J27(D:POP_H22_J27) U5.J28(D:POP_K1_J28) U5.K1(A:GPMC_D0) U5.K2(A:GPMC_D9) U5.K3(A:GPMC_A10) U5.K4(A:GPMC_A4) U5.K8(A:GPMC_WAIT2) U5.K21(D:I2C1_SCL) U5.K26(D:MCBSP1_FSX) U5.K27(D:CAM_D8) U5.K28(D:CAM_D6) U5.L1(A:GPMC_D1) U5.L2(A:GPMC_D2) U5.L3(A:GPMC_A9) U5.L4(A:GPMC_A3) U5.L8(A:GPMC_WAIT1) U5.L21(D:CAP_VDD_SRAM_CORE) U5.L25(D:CDD_CORE) U5.L27(D:CAM_D9) U5.L28(D:CAM_D7) U5.M1(A:POP_Y23_M1) U5.M2(A:POP_K2_M2) U5.M3(A:GPMC_A8) U5.M4(A:GPMC_A2) U5.M8(A:GPMC_WAIT0) U5.M21(D:MCBSP2_DX) U5.M26(D:POP_K22_M26) U5.M27(D:MMC1_CMD) U5.N1(A:POP_U1_N1) U5.N2(A:POP_I2_N2) U5.N3(A:GPMC_A7) U5.N4(A:GPMC_A1) U5.N8(A:GPMC_NCS7) U5.N21(D:MCBSP2_CLKX) U5.N25(D:MMC1_DAT2) U5.N26(D:MMC1_DAT1) U5.N27(D:MMC1_DA0) U5.N28(D:MMC1_CLK) U5.P1(A:GPMC_D10) U5.P2(A:GPMC_D3) U5.P8(B:GPMC_NCS6) U5.P21(D:MCBSP2_FSX) U5.P26(E:MMC1_DAT5) U5.P27(E:MMC1_DAT4) U5.P28(E:MMC1_DAT3) U5.R1(B:GPMC_D11) U5.R2(B:GPMC_D12) U5.R3(B:GPMC_A6) U5.R8(B:GPMC_NCS5) U5.R21(E:MCBSP2_DR) U5.R25(E:MMC1_DAT7) U5.R27(E:MMC1_DAT6) U5.R28(E:HSUSB0_DIR) U5.T1(B:GMC_D4) U5.T2(B:GPMC_D13) U5.T3(B:GPMC_A5) U5.T4(B:GPMC_CLK) U5.T8(B:GPMC_NCS4) U5.T21(E:MCBSP_CLKS) U5.T25(E:HSUSB0_STP) U5.T26(E:HSUSB0_NXT) U5.T27(E:HSUSB0_DATA0) U5.T28(E:HSUSB0_CLK) U5.U3(B:GPMC_NBE1) U5.U4(B:NC) U5.U8(B:GPMC_NCS3) U5.U21(E:MCBSP1_DR) U5.U25(E:HSUSB0_DATA4) U5.U26(E:HSUSB0_DATA3) U5.U27(E:HSUSB0_DATA2) U5.U28(E:HSUSB0_DATA1) U5.V1(B:GPMC_D5) U5.V2(B:GPMC_D6) U5.V3(B:MCSPI2_CS1) U5.V4(B:V4) U5.V8(B:GPMC_NCS2) U5.V21(E:MCBSP1_DX) U5.V26(E:HSUSB0_DATA7) U5.V27(E:HSUSB0_DATA6) U5.V28(E:HSUSB0_DATA5) U5.W1(B:GPMC_D14) U5.W2(B:GPMC_D7) U5.W8(B:UART1_CTS) U5.W21(E:MCBSP1_CLKX) U5.W26(E:TV_VREF) U5.W27(E:TV_VFB2) U5.W28(E:TV_OUT2) U5.Y1(B:GPMC_D15) U5.Y2(B:MCSPI2_SIMO) U5.Y3(B:MCSPI2_SOMI) U5.Y4(B:MCSPI2_CS0) U5.Y8(B:UART1_RX) U5.Y21(E:MCBSP1_CLKR) U5.Y27(E:TV_VFB1) U5.Y28(E:TV_OUT1)

## Sheet 6 of 6
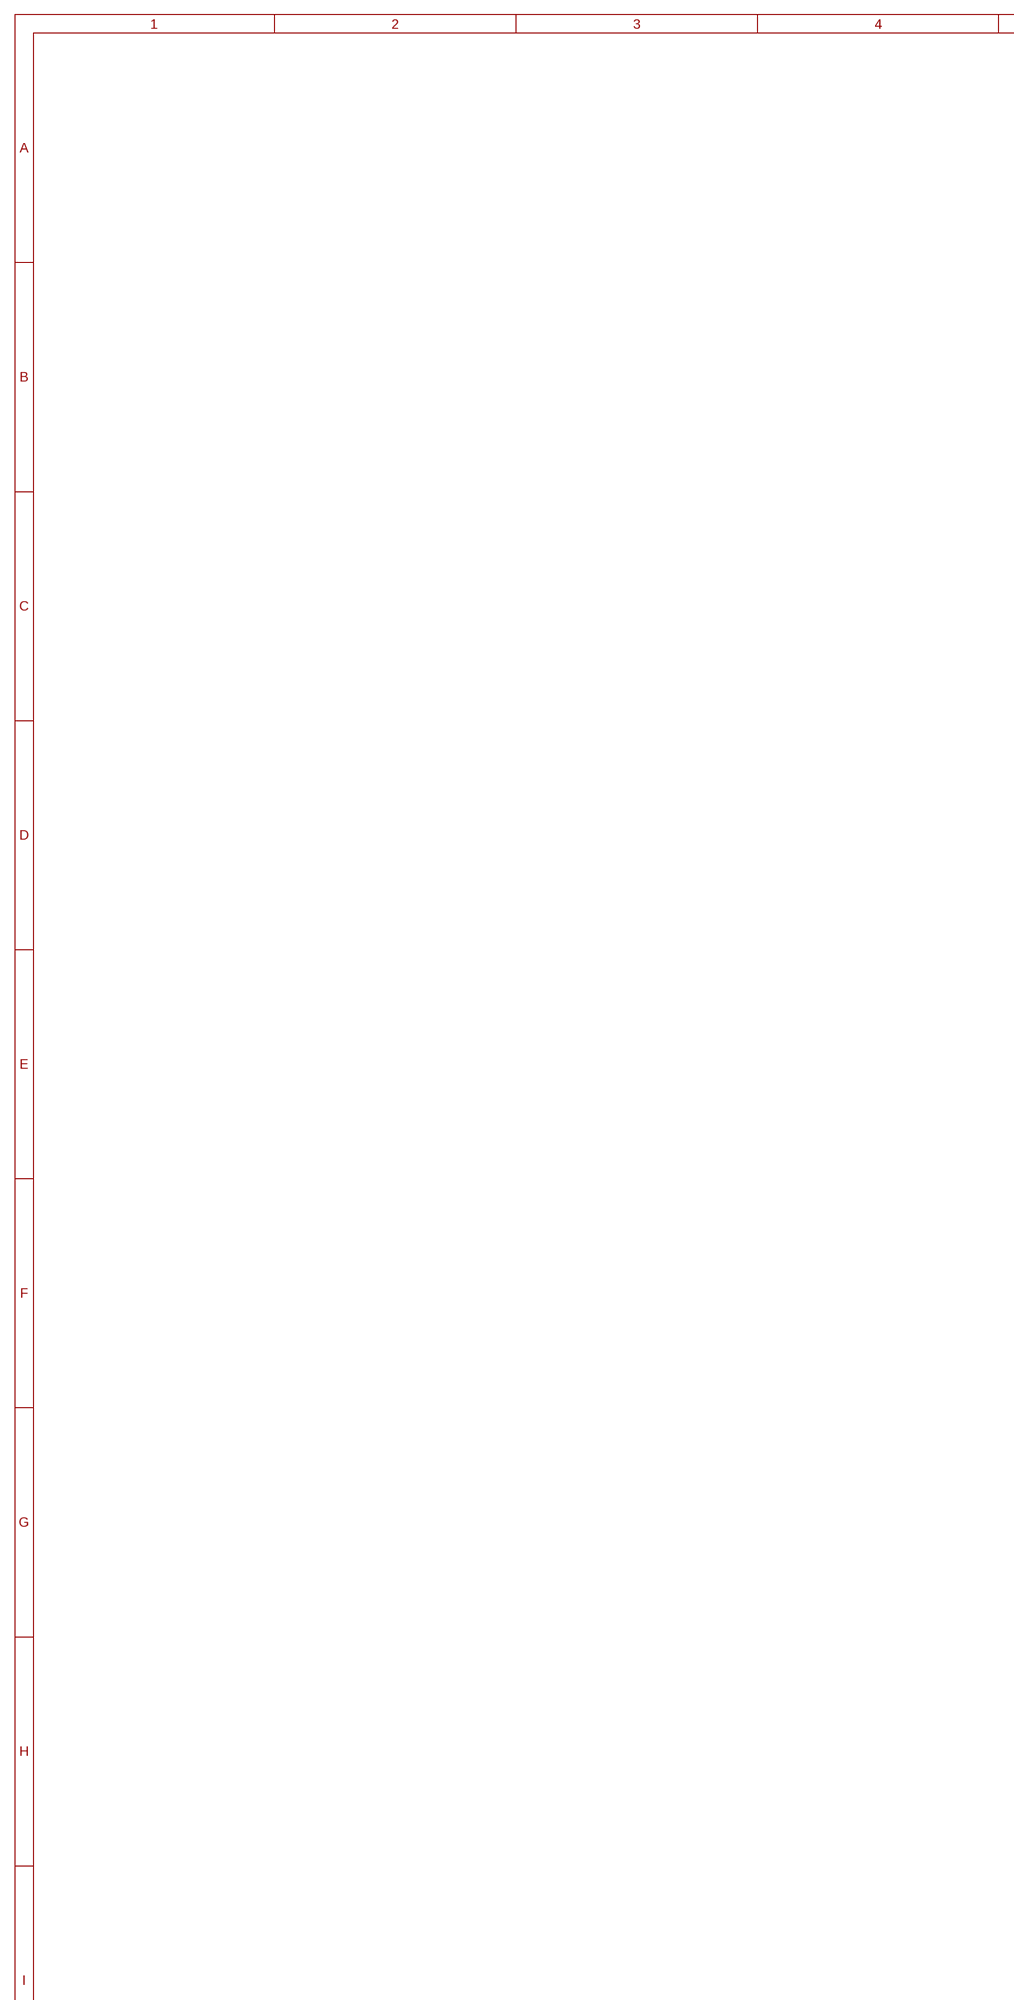
[diagram p10: schematic, sheet 6, part 1 of 2]
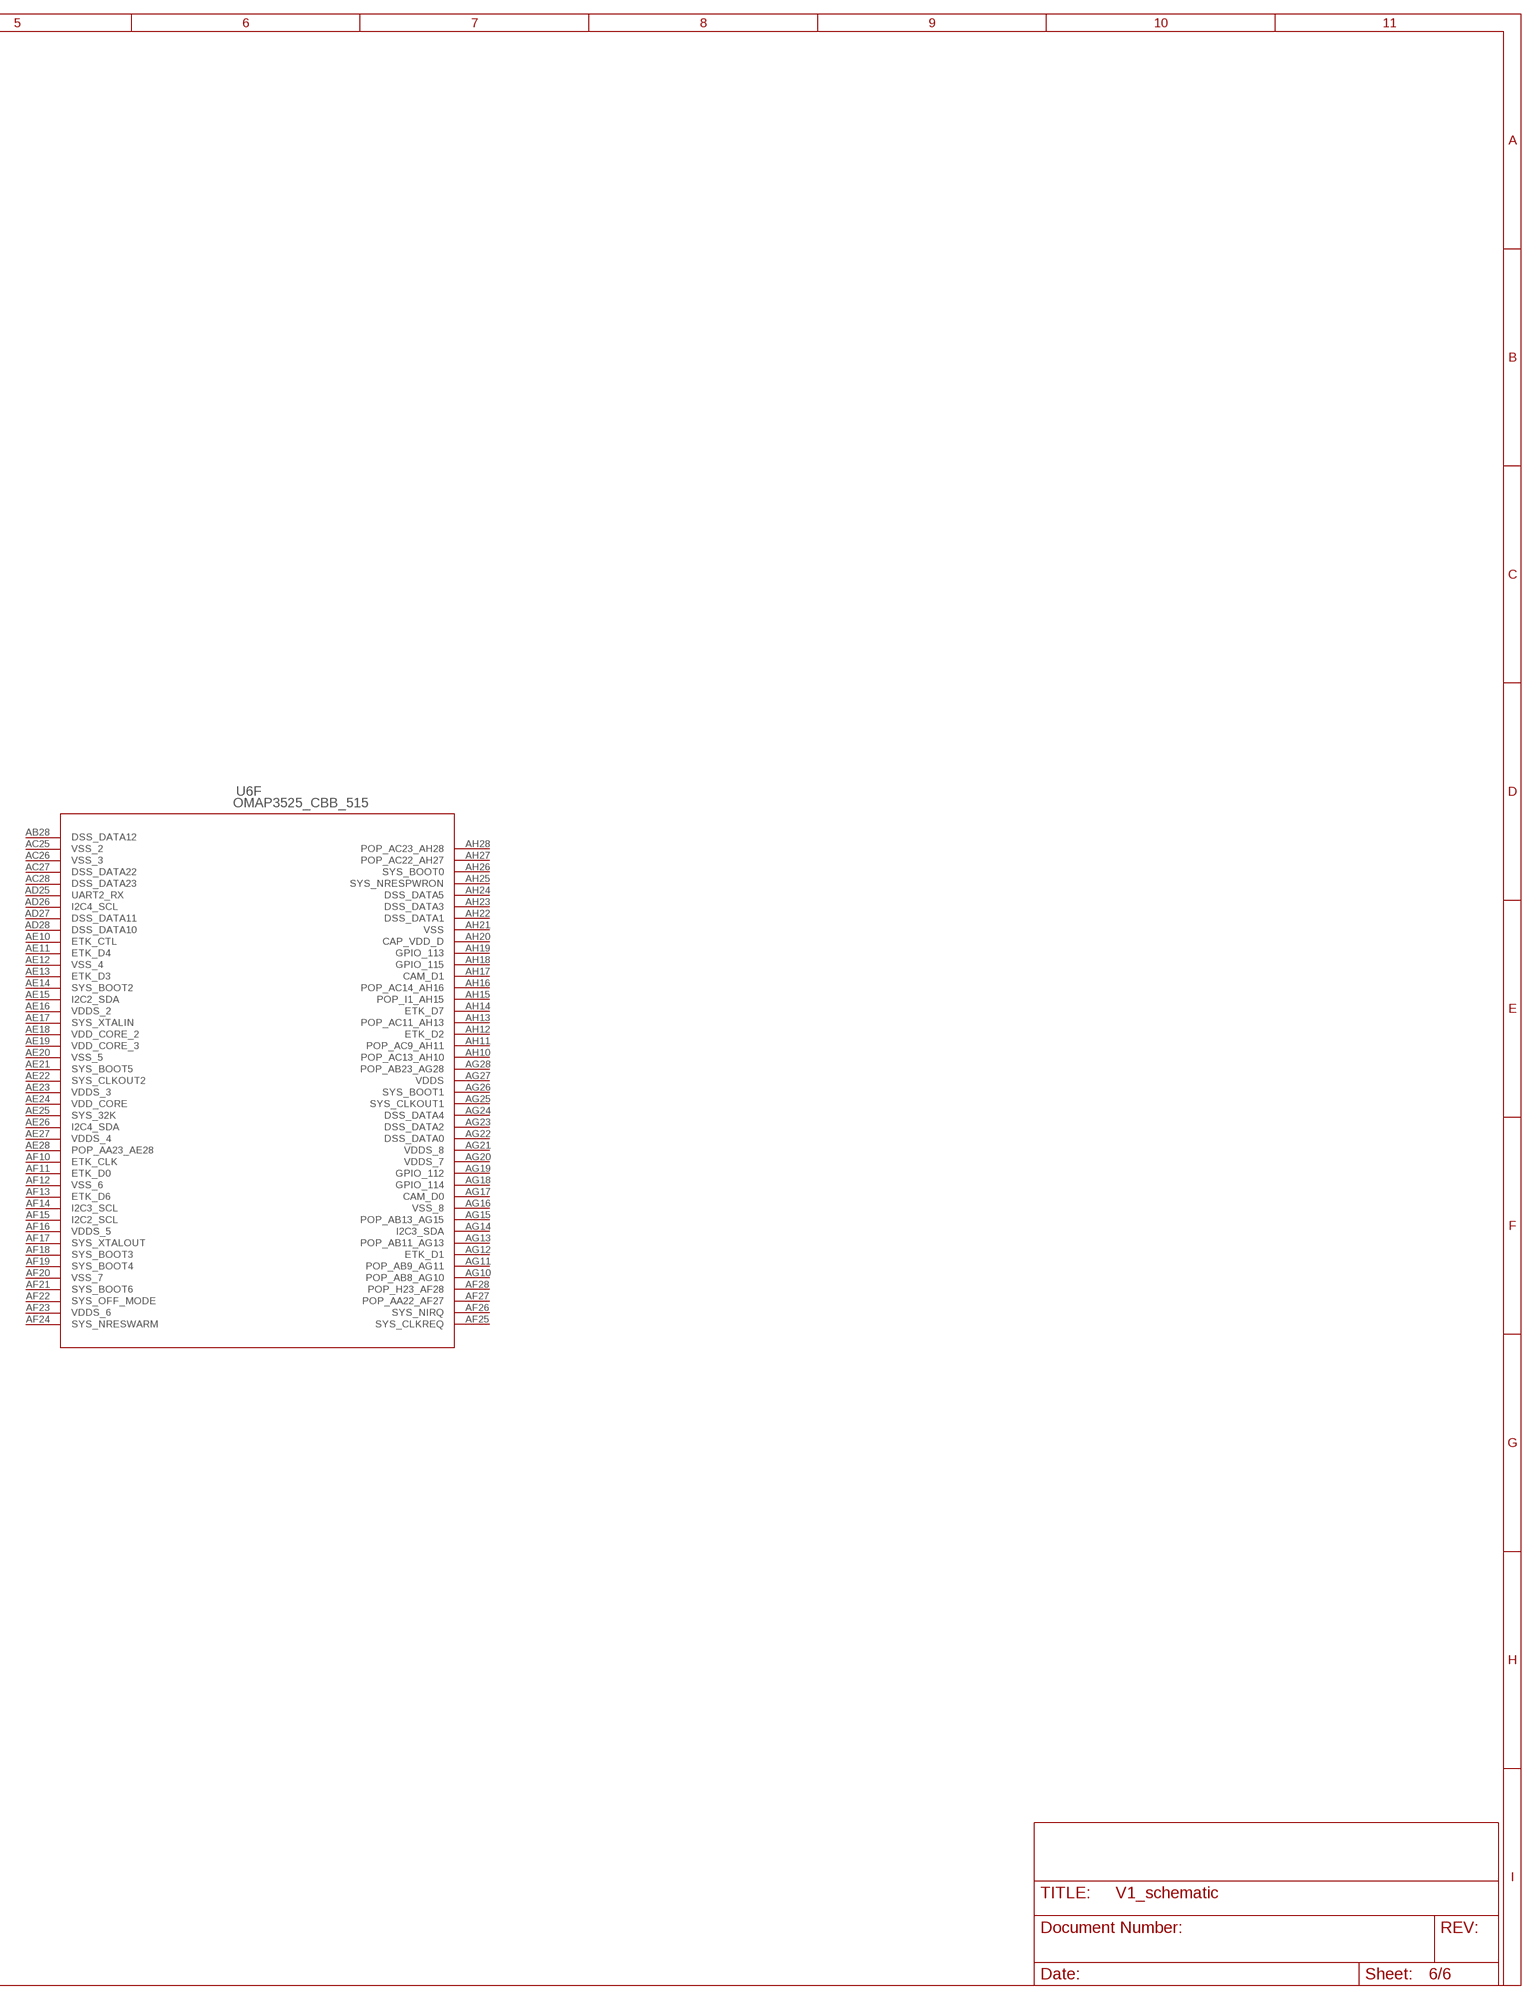
[diagram p11: schematic, sheet 6, part 2 of 2]

### Parts
U6  OMAP3525_CBB_515  [CBB515]
Unconnected: U6.A1(A:POP_A1_A1) U6.A2(A:POP_A2_A2) U6.A4(A:SDRC_A0) U6.A6(A:SDRC_DQS0) U6.A7(A:SDRC_D5) U6.A9(A:SDRC_D7) U6.A10(B:SDRC_DQS2) U6.A11(B:SDRC_D21) U6.A13(B:SDRC_CLK) U6.A14(B:SDRC_NCLK) U6.A15(B:POP_A12_A15) U6.A16(B:SDRC_DM1) U6.A17(B:SDRC_DQS1) U6.A19(B:SDRC_D25) U6.A20(B:SDRC_DQS3) U6.A21(B:SDRC_D29) U6.A23(B:CAM_VS) U6.A24(B:CAM_HS) U6.A25(B:CAM_D5) U6.A27(B:POP_A22_A27) U6.A28(B:POP_A23_A28) U6.AA1(B:POP_AA1_AA1) U6.AA2(B:POP_AA2_AA2) U6.AA3(B:MCSPI2_CLK) U6.AA4(B:MCSPI1_SOMI) U6.AA8(B:UART1_TX) U6.AA9(B:UART1_RTS) U6.AA10(E:JTAG_EMU1) U6.AA11(E:JTAG_EMU0) U6.AA12(E:JTAG_RTCK) U6.AA13(E:JTAG_TCK) U6.AA15(E:CAP_VDD_WKUP) U6.AA17(E:JTAG_NTRST) U6.AA18(E:JTAG_TMS_TMSC) U6.AA19(E:JTAG_TDO) U6.AA20(E:JTAG_TDI) U6.AA21(E:MCBSP1_FSR) U6.AA25(E:UART2_TX) U6.AA27(E:DSS_DATA15) U6.AA28(E:DSS_DATA14) U6.AB1(B:MCSPI1_CS2) U6.AB2(B:MCSPI1_CS3) U6.AB3(B:MCSPI1_CLK) U6.AB4(B:MCSPI1_SIMO) U6.AB25(E:UART2_RTS) U6.AB26(E:UART2_CTS) U6.AB27(E:DSS_DATA13) U6.AB28(F:DSS_DATA12) U6.AC1(B:MCSPI1_FSX) U6.AC2(B:MCSPI1_CS0) U6.AC3(B:MCSPI1_CS1) U6.AC27(F:DSS_DATA22) U6.AC28(F:DSS_DATA23) U6.AD1(B:MCBSP4_DR) U6.AD2(B:MCBSP4_DX) U6.AD25(F:UART2_RX) U6.AD26(F:I2C4_SCL) U6.AD27(F:DSS_DATA11) U6.AD28(F:DSS_DATA10) U6.AE1(B:MCBSP4_CLKX) U6.AE2(B:MMC2_CLK) U6.AE3(B:MMC2_DAT7) U6.AE4(B:MMC2_DAT4) U6.AE5(B:MCBSP3_FSX) U6.AE6(B:MCBSP3_DR) U6.AE7(B:ETK_D10) U6.AE10(F:ETK_CTL) U6.AE11(F:ETK_D4) U6.AE13(F:ETK_D3) U6.AE14(F:SYS_BOOT2) U6.AE15(F:I2C2_SDA) U6.AE17(F:SYS_XTALIN) U6.AE21(F:SYS_BOOT5) U6.AE22(F:SYS_CLKOUT2) U6.AE25(F:SYS_32K) U6.AE26(F:I2C4_SDA) U6.AE28(F:POP_AA23_AE28) U6.AF1(B:POP_AC8_AF1) U6.AF2(C:POP_U2_AF2) U6.AF3(C:MMC2_DAT6) U6.AF4(C:MMC2_DAT3) U6.AF5(C:MCBSP3_CLKX) U6.AF6(C:MCBSP3_DX) U6.AF7(C:ETK_D11) U6.AF9(C:ETK_D8) U6.AF10(F:ETK_CLK) U6.AF11(F:ETK_D0) U6.AF13(F:ETK_D6) U6.AF14(F:I2C3_SCL) U6.AF15(F:I2C2_SCL) U6.AF17(F:SYS_XTALOUT) U6.AF18(F:SYS_BOOT3) U6.AF19(F:SYS_BOOT4) U6.AF21(F:SYS_BOOT6) U6.AF22(F:SYS_OFF_MODE) U6.AF24(F:SYS_NRESWARM) U6.AF25(F:SYS_CLKREQ) U6.AF26(F:SYS_NIRQ) U6.AF27(F:POP_AA22_AF27) U6.AF28(F:POP_H23_AF28) U6.AG1(C:POP_AB1_AG1) U6.AG4(C:MMC2_DAT2) U6.AG5(C:MMC2_CMD) U6.AG7(C:ETK_D12) U6.AG8(C:ETK_D14) U6.AG9(C:ETK_D9) U6.AG10(F:POP_AB8_AG10) U6.AG11(F:POP_AB9_AG11) U6.AG12(F:ETK_D1) U6.AG13(F:POP_AB11_AG13) U6.AG14(F:I2C3_SDA) U6.AG15(F:POP_AB13_AG15) U6.AG17(F:CAM_D0) U6.AG18(F:GPIO_114) U6.AG19(F:GPIO_112) U6.AG22(F:DSS_DATA0) U6.AG23(F:DSS_DATA2) U6.AG24(F:DSS_DATA4) U6.AG25(F:SYS_CLKOUT1) U6.AG26(F:SYS_BOOT1) U6.AG28(F:POP_AB23_AG28) U6.AH1(C:POP_AC1_AH1) U6.AH2(C:POP_AC2_AH2) U6.AH3(C:MMC2_DAT5) U6.AH4(C:MMC2_DAT1) U6.AH5(C:MMC2_DAT0) U6.AH7(C:ETK_D13) U6.AH8(C:ETK_D15) U6.AH9(C:ETK_D5) U6.AH10(F:POP_AC13_AH10) U6.AH11(F:POP_AC9_AH11) U6.AH12(F:ETK_D2) U6.AH13(F:POP_AC11_AH13) U6.AH14(F:ETK_D7) U6.AH15(F:POP_I1_AH15) U6.AH16(F:POP_AC14_AH16) U6.AH17(F:CAM_D1) U6.AH18(F:GPIO_115) U6.AH19(F:GPIO_113) U6.AH20(F:CAP_VDD_D) U6.AH22(F:DSS_DATA1) U6.AH23(F:DSS_DATA3) U6.AH24(F:DSS_DATA5) U6.AH25(F:SYS_NRESPWRON) U6.AH26(F:SYS_BOOT0) U6.AH27(F:POP_AC22_AH27) U6.AH28(F:POP_AC23_AH28) U6.B1(A:POP_B1_B1) U6.B3(A:SDRC_A2) U6.B4(A:SDRC_A1) U6.B6(A:SDRC_D21) U6.B7(A:SDRC_DM0) U6.B9(A:SDRC_A6_2) U6.B10(C:SDRC_D17) U6.B11(C:SDRC_DM2) U6.B13(C:SDRC_D22) U6.B14(C:SDRC_D9) U6.B15(C:POP_B12_B15) U6.B16(C:SDRC_D11) U6.B17(C:SDRC_D14) U6.B19(C:SDRC_D26) U6.B20(C:SDRC_D27) U6.B21(C:SDRC_D30) U6.B23(C:CAM_WEN) U6.B24(C:CAM_D2) U6.B25(C:CAM_D10) U6.B26(C:CAM_XCLKB) U6.B28(C:POP_B23_B28) U6.C1(A:SDRC_A8) U6.C2(A:SDRC_A7) U6.C3(A:SDRC_A6) U6.C4(A:SDRC_A4) U6.C5(A:SDRC_A3) U6.C6(A:SDRC_D1) U6.C8(A:SDRC_D3) U6.C9(A:SDRC_D4) U6.C11(C:SDRC_D18) U6.C12(C:SDRC_D20) U6.C14(C:SDRC_D8) U6.C15(C:SDRC_D10) U6.C17(C:SDRC_D13) U6.C18(C:SDRC_D24) U6.C20(C:SDRC_DM3) U6.C21(C:SDRC_D31) U6.C23(C:CAM_FLD) U6.C24(C:CAM_D3) U6.C25(C:CAM_XCLKA) U6.C26(C:CAM_D11) U6.C27(C:CAM_PCLK) U6.D1(A:SDRC_A12) U6.D2(A:SDRC_A11) U6.D3(A:SDRC_A10) U6.D4(A:SDRC_A9) U6.D5(A:SDRC_A5) U6.D6(A:SDRC_D0) U6.D11(C:SDRC_D16) U6.D12(C:SDRC_D19) U6.D14(C:SDRC_D23) U6.D17(C:SDRC_D12) U6.D18(C:SDRC_D15) U6.D20(C:SDRC_D28) U6.D24(C:CAM_D4) U6.D25(C:CAM_STROBE) U6.D26(C:DSS_HSYNC) U6.D27(C:DSS_VSYNC) U6.D28(C:DSS_PCLK) U6.E1(A:SDRC_A14) U6.E2(A:SDRC_A13) U6.E26(C:DSS_DATA6) U6.E27(C:DSS_ACBIAS) U6.E28(D:DSS_DATA20) U6.F27(D:DSS_DATA8) U6.F28(D:DSS_DATA7) U6.G1(A:NC) U6.G2(A:GPMC_NOE) U6.G3(A:GPMC_NBE0_DE) U6.G4(A:GPMC_NCS0) U6.G25(D:DSS_DATA16) U6.G26(D:DSS_DATA9) U6.H1(A:GPMC_NWP) U6.H2(A:GPMC_D8) U6.H3(A:GPM_NCS1) U6.H9(A:SDRC_BA0) U6.H10(D:SDRC_BA1) U6.H11(D:SDRC_NCS0) U6.H12(D:SDRC_NCS1) U6.H13(D:SDRC_NCAS) U6.H14(D:SDRC_NRAS) U6.H15(D:SDRC_NWE) U6.H16(D:SDRC_CKE0) U6.H17(D:SDRC_CKE1) U6.H18(D:UART3_CTS_RCTX) U6.H19(D:UART3_RTS_SD) U6.H20(D:UART3_RX_IRRX) U6.H21(D:UART3_TX_IRTX) U6.H25(D:DSS_DATA19) U6.H26(D:DSS_DATA18) U6.H27(D:DSS_DATA17) U6.J8(A:GPMC_WAIT3) U6.J21(D:I2C1_SDA) U6.J25(D:HDQ_SIO) U6.J26(D:DSS_DATA21) U6.J27(D:POP_H22_J27) U6.J28(D:POP_K1_J28) U6.K1(A:GPMC_D0) U6.K2(A:GPMC_D9) U6.K3(A:GPMC_A10) U6.K4(A:GPMC_A4) U6.K8(A:GPMC_WAIT2) U6.K21(D:I2C1_SCL) U6.K26(D:MCBSP1_FSX) U6.K27(D:CAM_D8) U6.K28(D:CAM_D6) U6.L1(A:GPMC_D1) U6.L2(A:GPMC_D2) U6.L3(A:GPMC_A9) U6.L4(A:GPMC_A3) U6.L8(A:GPMC_WAIT1) U6.L21(D:CAP_VDD_SRAM_CORE) U6.L25(D:CDD_CORE) U6.L27(D:CAM_D9) U6.L28(D:CAM_D7) U6.M1(A:POP_Y23_M1) U6.M2(A:POP_K2_M2) U6.M3(A:GPMC_A8) U6.M4(A:GPMC_A2) U6.M8(A:GPMC_WAIT0) U6.M21(D:MCBSP2_DX) U6.M26(D:POP_K22_M26) U6.M27(D:MMC1_CMD) U6.N1(A:POP_U1_N1) U6.N2(A:POP_I2_N2) U6.N3(A:GPMC_A7) U6.N4(A:GPMC_A1) U6.N8(A:GPMC_NCS7) U6.N21(D:MCBSP2_CLKX) U6.N25(D:MMC1_DAT2) U6.N26(D:MMC1_DAT1) U6.N27(D:MMC1_DA0) U6.N28(D:MMC1_CLK) U6.P1(A:GPMC_D10) U6.P2(A:GPMC_D3) U6.P8(B:GPMC_NCS6) U6.P21(D:MCBSP2_FSX) U6.P26(E:MMC1_DAT5) U6.P27(E:MMC1_DAT4) U6.P28(E:MMC1_DAT3) U6.R1(B:GPMC_D11) U6.R2(B:GPMC_D12) U6.R3(B:GPMC_A6) U6.R8(B:GPMC_NCS5) U6.R21(E:MCBSP2_DR) U6.R25(E:MMC1_DAT7) U6.R27(E:MMC1_DAT6) U6.R28(E:HSUSB0_DIR) U6.T1(B:GMC_D4) U6.T2(B:GPMC_D13) U6.T3(B:GPMC_A5) U6.T4(B:GPMC_CLK) U6.T8(B:GPMC_NCS4) U6.T21(E:MCBSP_CLKS) U6.T25(E:HSUSB0_STP) U6.T26(E:HSUSB0_NXT) U6.T27(E:HSUSB0_DATA0) U6.T28(E:HSUSB0_CLK) U6.U3(B:GPMC_NBE1) U6.U4(B:NC) U6.U8(B:GPMC_NCS3) U6.U21(E:MCBSP1_DR) U6.U25(E:HSUSB0_DATA4) U6.U26(E:HSUSB0_DATA3) U6.U27(E:HSUSB0_DATA2) U6.U28(E:HSUSB0_DATA1) U6.V1(B:GPMC_D5) U6.V2(B:GPMC_D6) U6.V3(B:MCSPI2_CS1) U6.V4(B:V4) U6.V8(B:GPMC_NCS2) U6.V21(E:MCBSP1_DX) U6.V26(E:HSUSB0_DATA7) U6.V27(E:HSUSB0_DATA6) U6.V28(E:HSUSB0_DATA5) U6.W1(B:GPMC_D14) U6.W2(B:GPMC_D7) U6.W8(B:UART1_CTS) U6.W21(E:MCBSP1_CLKX) U6.W26(E:TV_VREF) U6.W27(E:TV_VFB2) U6.W28(E:TV_OUT2) U6.Y1(B:GPMC_D15) U6.Y2(B:MCSPI2_SIMO) U6.Y3(B:MCSPI2_SOMI) U6.Y4(B:MCSPI2_CS0) U6.Y8(B:UART1_RX) U6.Y21(E:MCBSP1_CLKR) U6.Y27(E:TV_VFB1) U6.Y28(E:TV_OUT1)